# EAGLE design hedwig (EAGLE 9.6.2)

## Sheet 1 of 6
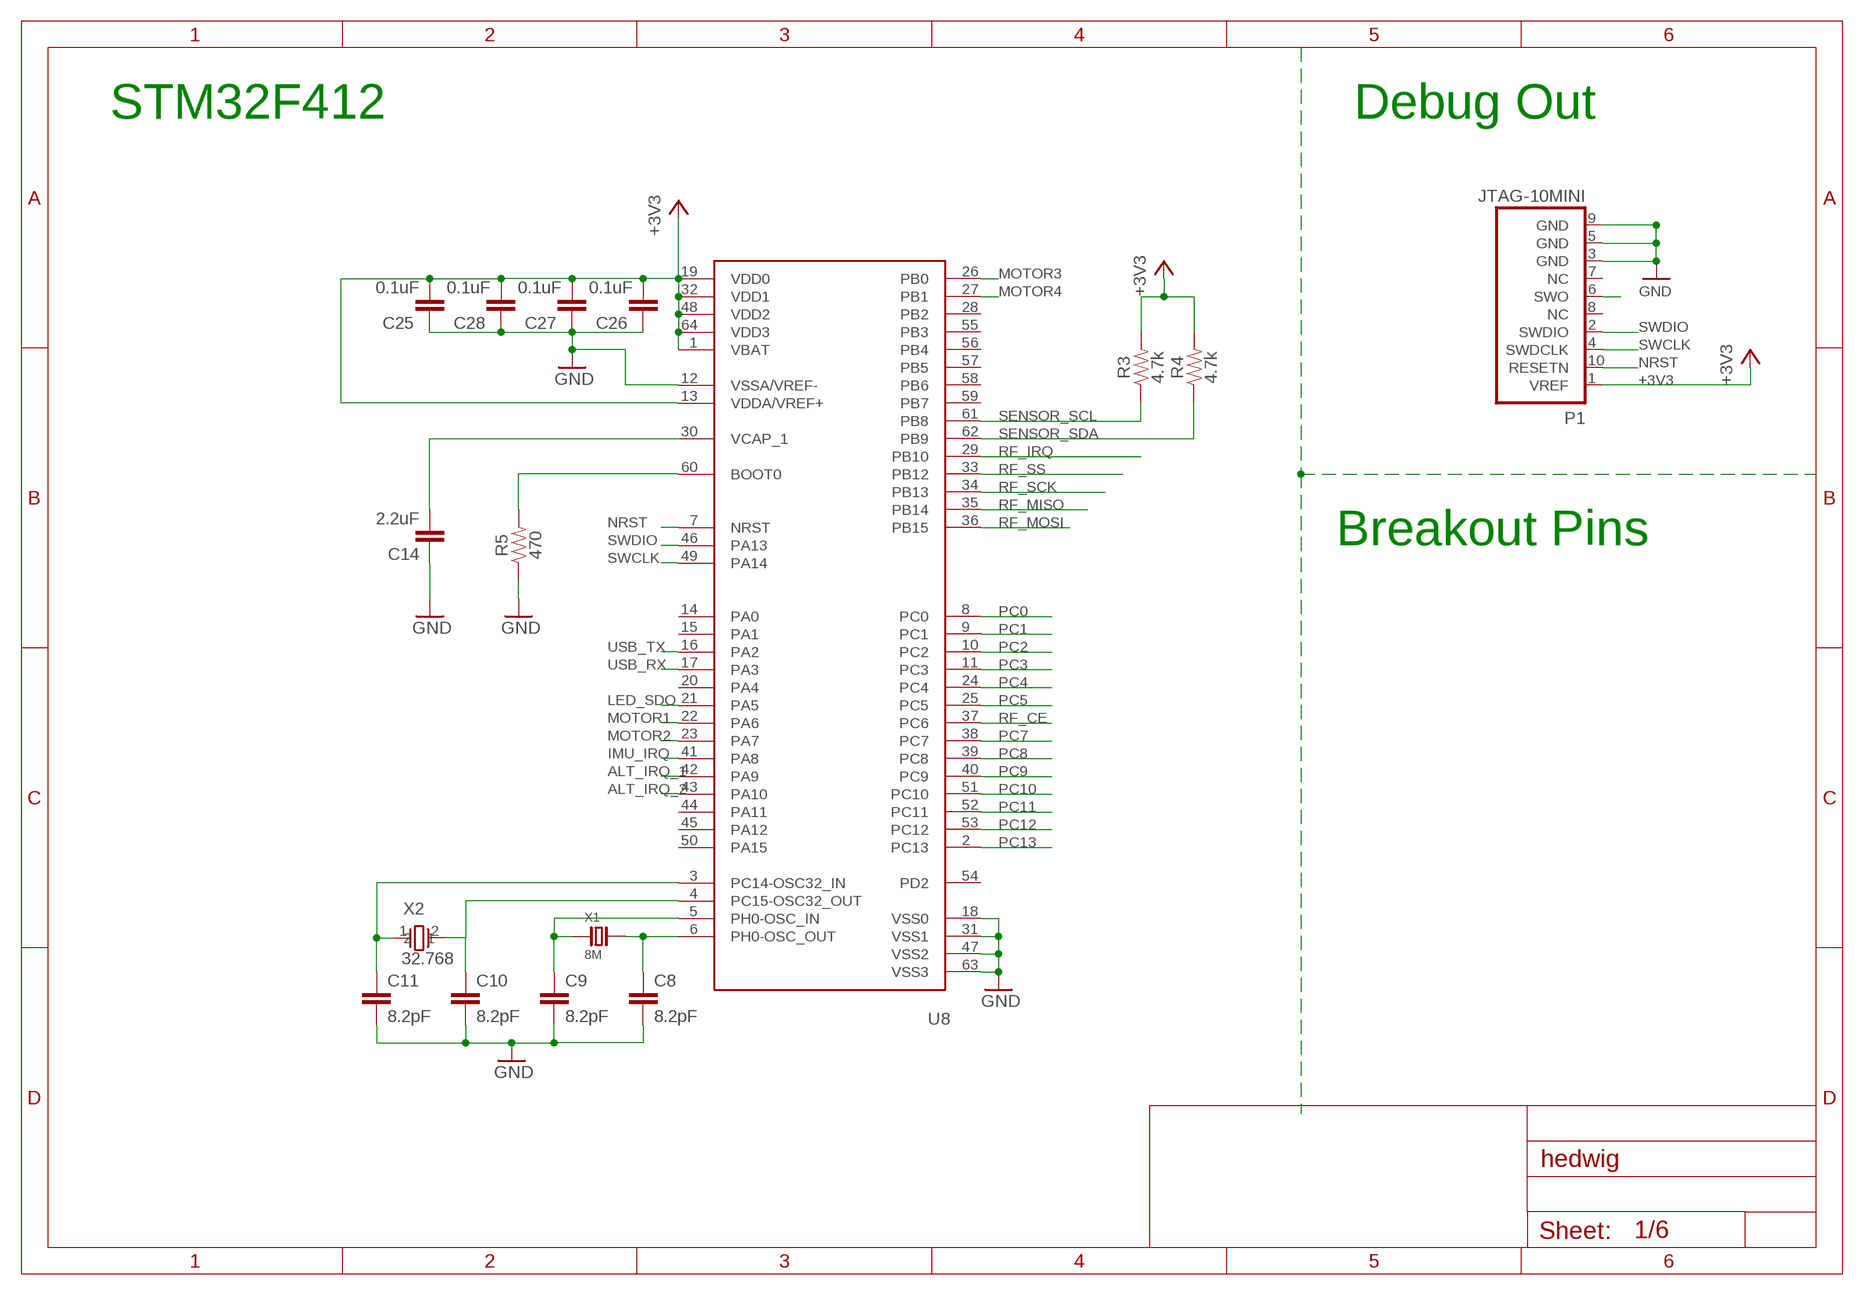
[diagram p0: schematic, sheet 1]

### Parts
C8  8.2pF  CAPACITOR_0603  [0603]
C9  8.2pF  CAPACITOR_0603  [0603]
C10  8.2pF  CAPACITOR_0603  [0603]
C11  8.2pF  CAPACITOR_0603  [0603]
C14  2.2uF  0.1UF-0603-25V-(+80/-20%)  [0603]
C25  0.1uF  0.1UF-0603-25V-(+80/-20%)  [0603]
C26  0.1uF  0.1UF-0603-25V-(+80/-20%)  [0603]
C27  0.1uF  0.1UF-0603-25V-(+80/-20%)  [0603]
C28  0.1uF  0.1UF-0603-25V-(+80/-20%)  [0603]
P1  JTAG-10MINI  [JTAG-10MINI]
R3  4.7k  1.5KOHM-0603-1/10W-1%  [0603]
R4  4.7k  1.5KOHM-0603-1/10W-1%  [0603]
R5  470  1.5KOHM-0603-1/10W-1%  [0603]
U8  STM32F412RE-S  [QFP50P1200X1200X160-64N]
X1  8M  CRYSTAL-NX3225GD  [NDK-NX3225GD]
X2  32.768  NX32  [NDK_NX3215SA-32.768K-STD-MUA-8_0]

### Nets
+3V3: C25.2 C26.2 C27.2 C28.2 P1.1(VREF) R3.2 R4.2 U8.1(VBAT) U8.13(VDDA/VREF+) U8.19(VDD0) U8.32(VDD1) U8.48(VDD2) U8.64(VDD3) ; also sheet 2,3,4,5,6
ALT_IRQ_1: U8.42(PA9) ; also sheet 3
ALT_IRQ_2: U8.43(PA10) ; also sheet 3
GND: C8.2 C9.2 C10.2 C11.2 C14.1 C25.1 C26.1 C27.1 C28.1 P1.3(GND) P1.5(GND) P1.9(GND) R5.1 U8.12(VSSA/VREF-) U8.18(VSS0) U8.31(VSS1) U8.47(VSS2) U8.63(VSS3) ; also sheet 2,3,4,5,6
IMU_IRQ: U8.41(PA8) ; also sheet 3
LED_SDO: U8.21(PA5) ; also sheet 5
MOTOR1: U8.22(PA6) ; also sheet 6
MOTOR2: U8.23(PA7) ; also sheet 6
MOTOR3: U8.26(PB0) ; also sheet 6
MOTOR4: U8.27(PB1) ; also sheet 6
N$8: C9.1 U8.5(PH0-OSC_IN) X1.1
N$10: C8.1 U8.6(PH0-OSC_OUT) X1.2
N$13: C11.1 U8.3(PC14-OSC32_IN) X2.1
N$14: C10.1 U8.4(PC15-OSC32_OUT) X2.2
N$16: R5.2 U8.60(BOOT0)
N$17: C14.2 U8.30(VCAP_1)
N$18: P1.6(SWO)
NRST: P1.10(RESETN) U8.7(NRST) ; also sheet 5
PC0: U8.8(PC0)
PC1: U8.9(PC1)
PC2: U8.10(PC2)
PC3: U8.11(PC3)
PC4: U8.24(PC4)
PC5: U8.25(PC5)
PC7: U8.38(PC7)
PC8: U8.39(PC8)
PC9: U8.40(PC9)
PC10: U8.51(PC10)
PC11: U8.52(PC11)
PC12: U8.53(PC12)
PC13: U8.2(PC13)
RF_CE: U8.37(PC6) ; also sheet 2
RF_IRQ: U8.29(PB10) ; also sheet 2
RF_MISO: U8.35(PB14) ; also sheet 2
RF_MOSI: U8.36(PB15) ; also sheet 2
RF_SCK: U8.34(PB13) ; also sheet 2
RF_SS: U8.33(PB12) ; also sheet 2
SENSOR_SCL: R3.1 U8.61(PB8) ; also sheet 3
SENSOR_SDA: R4.1 U8.62(PB9) ; also sheet 3
SWCLK: P1.4(SWDCLK) U8.49(PA14)
SWDIO: P1.2(SWDIO) U8.46(PA13)
USB_RX: U8.17(PA3) ; also sheet 4
USB_TX: U8.16(PA2) ; also sheet 4
Unconnected: P1.7(NC) P1.8(NC) U8.14(PA0) U8.15(PA1) U8.20(PA4) U8.28(PB2) U8.44(PA11) U8.45(PA12) U8.50(PA15) U8.54(PD2) U8.55(PB3) U8.56(PB4) U8.57(PB5) U8.58(PB6) U8.59(PB7)

### Notes on the sheet
- STM32F412 | Debug Out
- Breakout Pins

## Sheet 2 of 6
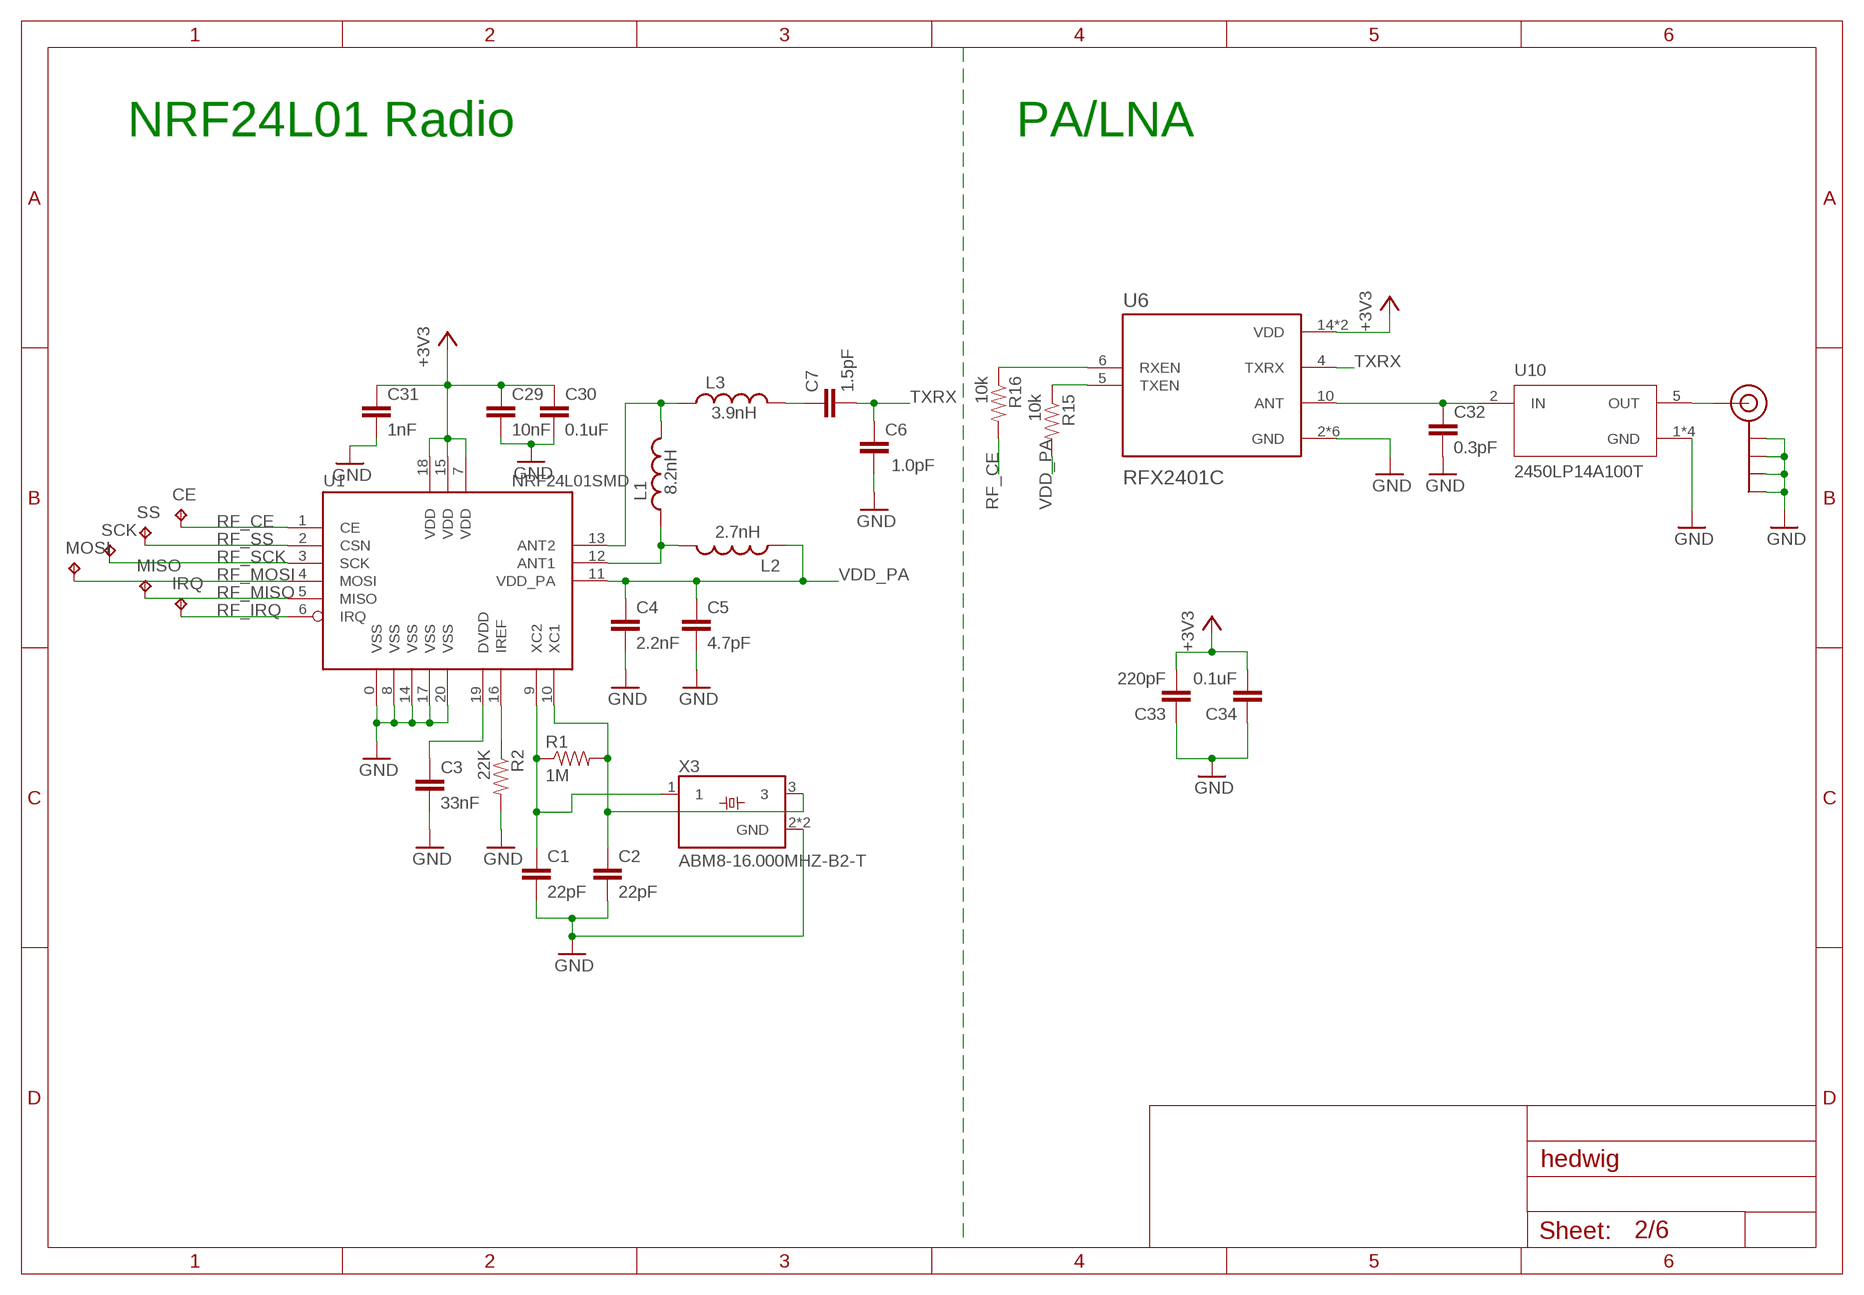
[diagram p1: schematic, sheet 2]

### Parts
C1  22pF  CAP0402  [C0402]
C2  22pF  CAP0402  [C0402]
C3  33nF  CAP0402  [C0402]
C4  2.2nF  CAP0402  [C0402]
C5  4.7pF  CAP0402  [C0402]
C6  1.0pF  CAP0402  [C0402]
C7  1.5pF  CAP0402  [C0402]
C29  10nF  CAP0402  [C0402]
C30  0.1uF  CAP0402  [C0402]
C31  1nF  CAP0402  [C0402]
C32  0.3pF  CAP0402  [C0402]
C33  220pF  CAP0402  [C0402]
C34  0.1uF  CAP0402  [C0402]
CE  TPB1,27  [B1,27]
IRQ  TPB1,27  [B1,27]
J3  SMA_EDGE  [SMA-EDGE]
L1  8.2nH  INDUCTOR0402  [C0402]
L2  2.7nH  INDUCTOR0402  [C0402]
L3  3.9nH  INDUCTOR0402  [C0402]
MISO  TPB1,27  [B1,27]
MOSI  TPB1,27  [B1,27]
R1  1M  RESISTOR0402  [C0402]
R2  22K  RESISTOR0402  [C0402]
R15  10k  RESISTOR0402  [C0402]
R16  10k  RESISTOR0402  [C0402]
SCK  TPB1,27  [B1,27]
SS  TPB1,27  [B1,27]
U1  NRF24L01SMD  [QFN20]
U6  RFX2401C  [QFN50P300X300X60-17N]
U10  2450LP14A100T  [ICCAF50P160X80X70-6N]
X3  ABM8-16.000MHZ-B2-T  [OSCSC320X250X100N]

### Nets
+3V3: C29.1 C30.1 C31.1 C33.2 C34.2 U1.7(VDD) U1.15(VDD) U1.18(VDD) U6.14(VDD) U6.16(VDD) ; also sheet 1,3,4,5,6
GND: C1.2 C2.2 C3.2 C4.2 C5.2 C6.1 C29.2 C30.2 C31.2 C32.2 C33.1 C34.1 J3.GND@0(GND) J3.GND@1(GND) J3.GND@2(GND) J3.GND@3(GND) R2.2 U1.0(VSS) U1.8(VSS) U1.14(VSS) U1.17(VSS) U1.20(VSS) U6.2(GND) U6.3(GND) U6.8(GND) U6.9(GND) U6.11(GND) U6.17(GND) U10.1(GND) U10.3(GND) U10.4(GND) U10.6(GND) X3.2(GND) X3.4(GND) ; also sheet 1,3,4,5,6
N$1: C1.1 R1.1 U1.9(XC2) X3.1
N$2: C2.1 R1.2 U1.10(XC1) X3.3
N$3: L1.1 L2.2 U1.12(ANT1)
N$4: R2.1 U1.16(IREF)
N$5: C3.1 U1.19(DVDD)
N$6: L1.2 L3.1 U1.13(ANT2)
N$9: C7.1 L3.2
N$37: C32.1 U6.10(ANT) U10.2(IN)
N$53: J3.SIG(SIGNAL) U10.5(OUT)
N$57: R16.1 U6.6(RXEN)
N$58: R15.1 U6.5(TXEN)
RF_CE: CE.TP R16.2 U1.1(CE) ; also sheet 1
RF_IRQ: IRQ.TP U1.6(IRQ) ; also sheet 1
RF_MISO: MISO.TP U1.5(MISO) ; also sheet 1
RF_MOSI: MOSI.TP U1.4(MOSI) ; also sheet 1
RF_SCK: SCK.TP U1.3(SCK) ; also sheet 1
RF_SS: SS.TP U1.2(CSN) ; also sheet 1
TXRX: C6.2 C7.2 U6.4(TXRX)
VDD_PA: C4.1 C5.1 L2.1 R15.2 U1.11(VDD_PA)

### Notes on the sheet
- NRF24L01 Radio | PA/LNA

## Sheet 3 of 6
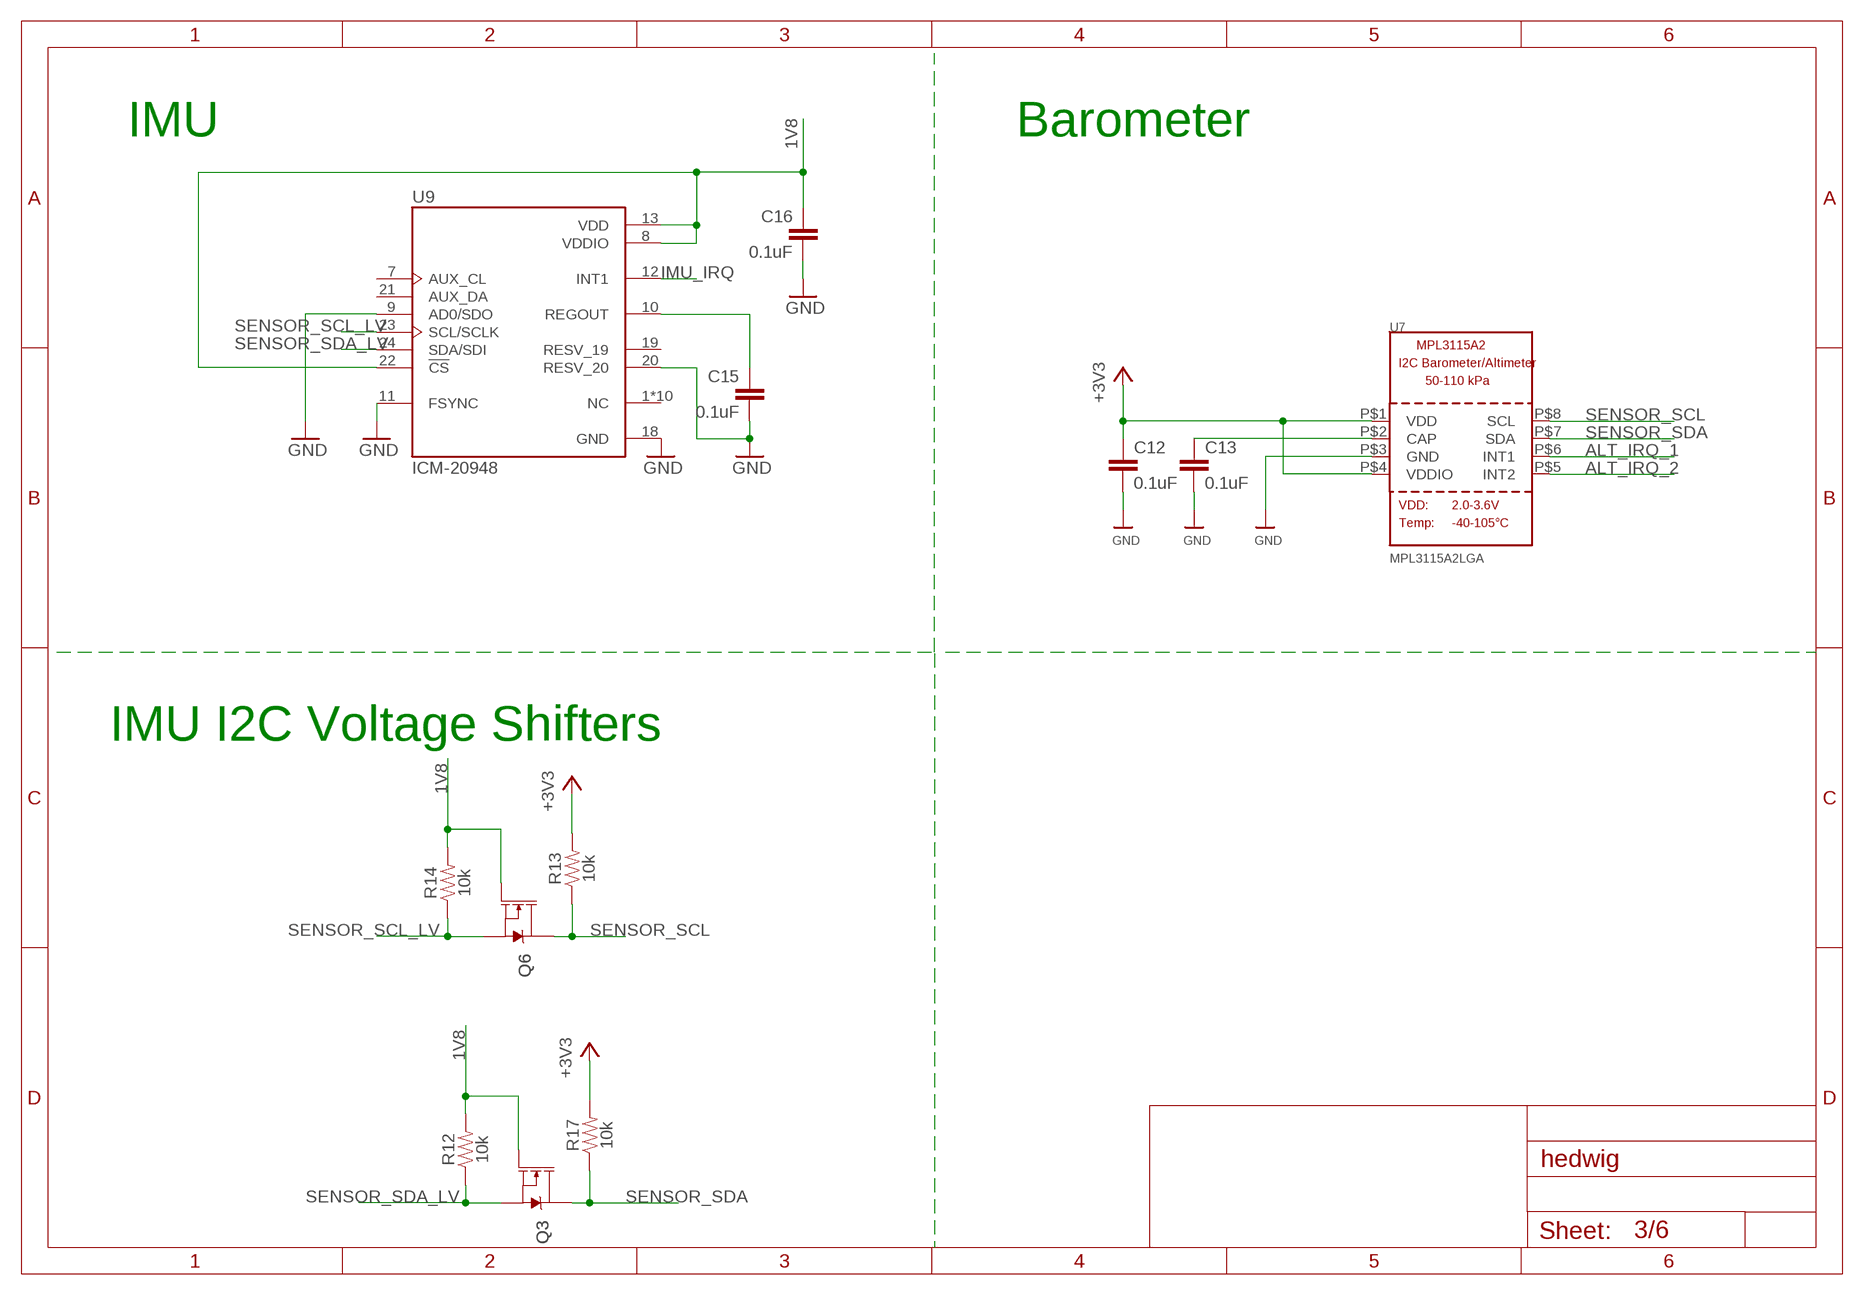
[diagram p2: schematic, sheet 3]

### Parts
C12  0.1uF  CAPACITOR_0603  [0603]
C13  0.1uF  CAPACITOR_0603  [0603]
C15  0.1uF  0.1UF-25V(+80/-20%)(0603)  [0603-CAP]
C16  0.1uF  0.1UF-25V(+80/-20%)(0603)  [0603-CAP]
Q3  20V/0.2A/8MHz/1.2Ω/1Vth  MOSFET-NCH-RE1C002UN  [SOT-416FL]
Q6  20V/0.2A/8MHz/1.2Ω/1Vth  MOSFET-NCH-RE1C002UN  [SOT-416FL]
R12  10k  2.49KOHM-0603-1/10W-1%  [0603]
R13  10k  2.49KOHM-0603-1/10W-1%  [0603]
R14  10k  2.49KOHM-0603-1/10W-1%  [0603]
R17  10k  2.49KOHM-0603-1/10W-1%  [0603]
U7  MPL3115A2LGA  [LGA8]
U9  ICM-20948  [QFN40P300X300X105-24N]

### Nets
1V8: C16.1 Q3.1(G) Q6.1(G) R12.2 R14.2 U9.8(VDDIO) U9.13(VDD) U9.22(!CS) ; also sheet 6
+3V3: C12.1 R13.2 R17.2 U7.P$1(VDD) U7.P$4(VDDIO) ; also sheet 1,2,4,5,6
ALT_IRQ_1: U7.P$6(INT1) ; also sheet 1
ALT_IRQ_2: U7.P$5(INT2) ; also sheet 1
CAP: C13.1 U7.P$2(CAP)
GND: C12.2 C13.2 C15.2 C16.2 U7.P$3(GND) U9.9(AD0/SDO) U9.11(FSYNC) U9.18(GND) U9.20(RESV_20) ; also sheet 1,2,4,5,6
IMU_IRQ: U9.12(INT1) ; also sheet 1
N$39: C15.1 U9.10(REGOUT)
SENSOR_SCL: Q6.3(D) R13.1 U7.P$8(SCL) ; also sheet 1
SENSOR_SCL_LV: Q6.2(S) R14.1 U9.23(SCL/SCLK)
SENSOR_SDA: Q3.3(D) R17.1 U7.P$7(SDA) ; also sheet 1
SENSOR_SDA_LV: Q3.2(S) R12.1 U9.24(SDA/SDI)
Unconnected: U9.1(NC) U9.2(NC) U9.3(NC) U9.4(NC) U9.5(NC) U9.6(NC) U9.7(AUX_CL) U9.14(NC) U9.15(NC) U9.16(NC) U9.17(NC) U9.19(RESV_19) U9.21(AUX_DA)

### Notes on the sheet
- IMU | Barometer
- IMU I2C Voltage Shifters

## Sheet 4 of 6
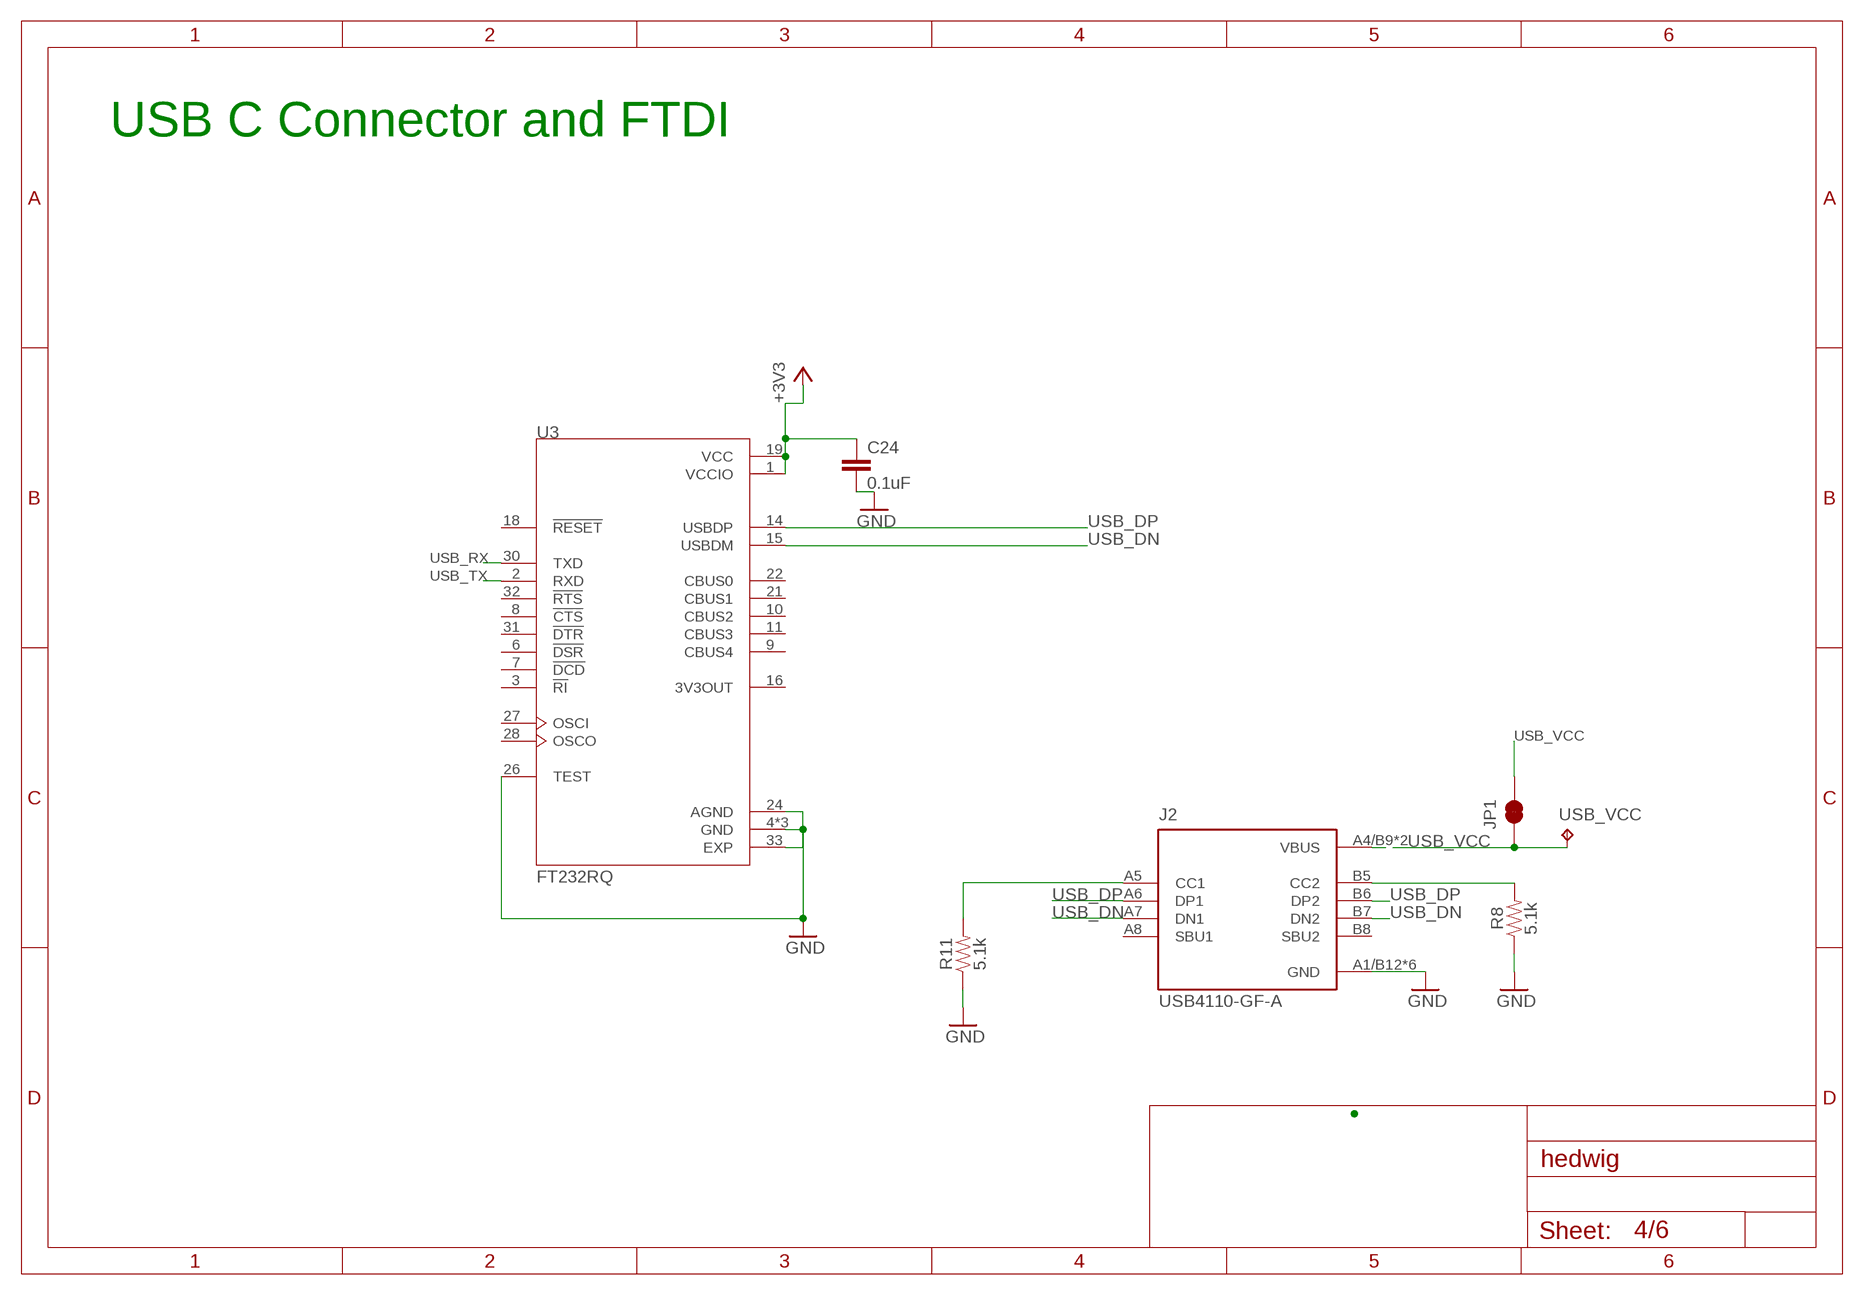
[diagram p3: schematic, sheet 4]

### Parts
C24  0.1uF  0.22UF-0603-25V-10%  [0603]
J2  USB4110-GF-A  [GCT_USB4110-GF-A]
JP1  JUMPER-SMT_2_NC_TRACE_SILK  [SMT-JUMPER_2_NC_TRACE_SILK]
R8  5.1k  5.1KOHM5.1KOHM-0603-1/10W-1%  [0603]
R11  5.1k  5.1KOHM5.1KOHM-0603-1/10W-1%  [0603]
U3  FT232RQ  [QFN50P500X500X90-33N]
USB_VCC  TPB2,54  [B2,54]

### Nets
+3V3: C24.1 U3.1(VCCIO) U3.19(VCC) ; also sheet 1,2,3,5,6
GND: C24.2 J2.A1/B12(GND) J2.B1/A12(GND) J2.S1(GND) J2.S2(GND) J2.S3(GND) J2.S4(GND) R8.1 R11.1 U3.4(GND) U3.17(GND) U3.20(GND) U3.24(AGND) U3.26(TEST) U3.33(EXP) ; also sheet 1,2,3,5,6
N$7: J2.B5(CC2) R8.2
N$26: J2.A5(CC1) R11.2
USB_DN: J2.A7(DN1) J2.B7(DN2) U3.15(USBDM)
USB_DP: J2.A6(DP1) J2.B6(DP2) U3.14(USBDP)
USB_RX: U3.30(TXD) ; also sheet 1
USB_TX: U3.2(RXD) ; also sheet 1
USB_VCC: J2.A4/B9(VBUS) J2.B4/A9(VBUS) JP1.1 JP1.2 USB_VCC.TP ; also sheet 5
Unconnected: J2.A8(SBU1) J2.B8(SBU2) U3.3(!RI) U3.6(!DSR) U3.7(!DCD) U3.8(!CTS) U3.9(CBUS4) U3.10(CBUS2) U3.11(CBUS3) U3.16(3V3OUT) U3.18(!RESET) U3.21(CBUS1) U3.22(CBUS0) U3.27(OSCI) U3.28(OSCO) U3.31(!DTR) U3.32(!RTS)

### Notes on the sheet
- USB C Connector and FTDI

## Sheet 5 of 6
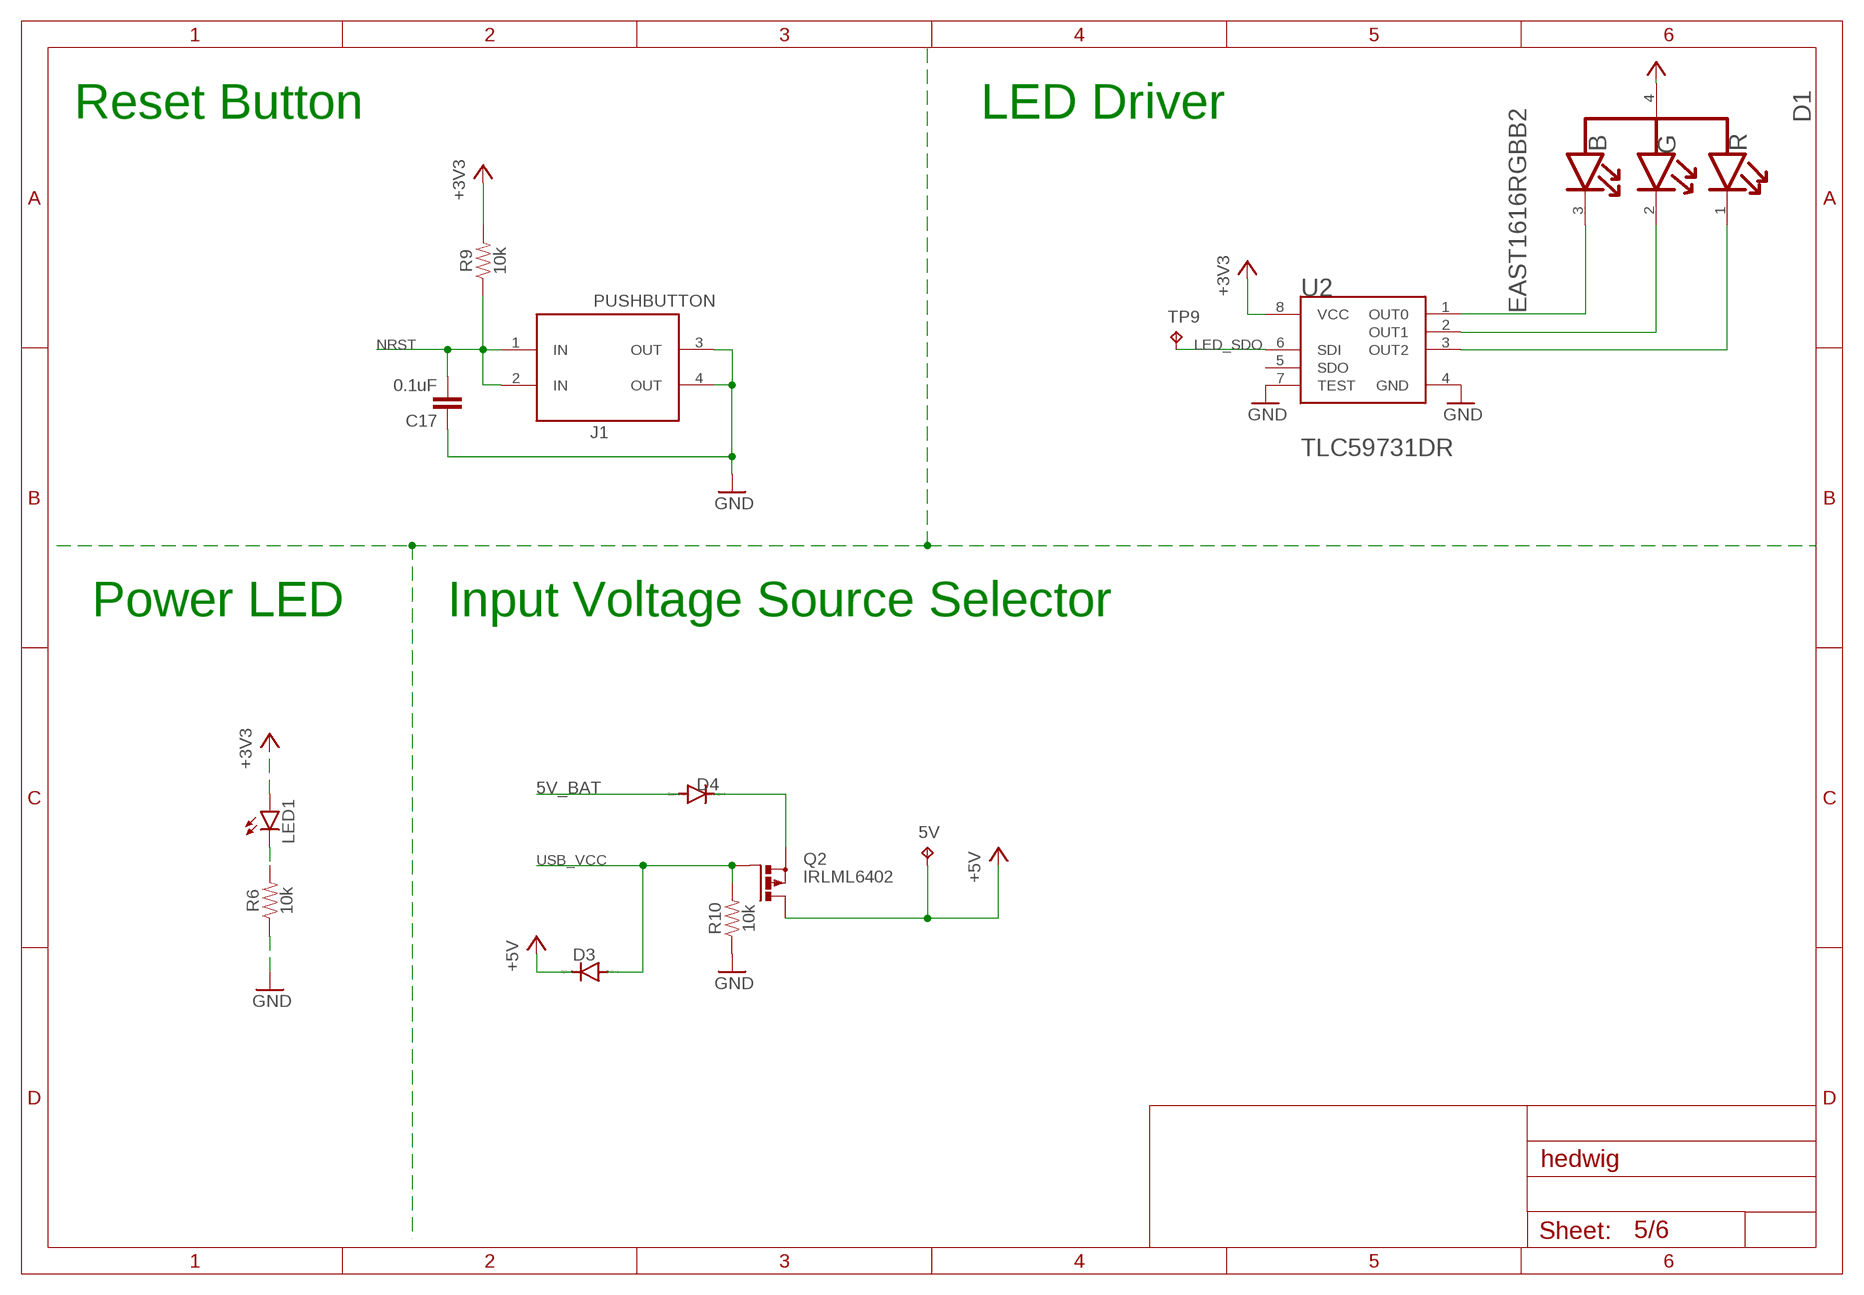
[diagram p4: schematic, sheet 5]

### Parts
5V  TPB2,54  [B2,54]
C17  0.1uF  0.1UF-0603-25V-(+80/-20%)  [0603]
D1  EVERLIGHT_EAST1616RGBB2EVERLIGHT_EAST1616RGBB2_0_0  [EVERLIGHT_EAST1616RGBB2_0]
D3  DIODE_0603  [DIODE_0603]
D4  DIODE_0603  [DIODE_0603]
J1  PUSHBUTTON  [PUSH_BUTTON]
LED1  LEDCHIPLED_1206  [CHIPLED_1206]
Q2  IRLML6402  [SOT-23]
R6  10k  10KOHM-0603-1/10W-1%  [0603]
R9  10k  1.5KOHM-0603-1/10W-1%  [0603]
R10  10k  2.49KOHM-0603-1/10W-1%  [0603]
TP9  TPB1,27  [B1,27]
U2  TEXAS_INSTRUMENTS_TLC59731DRTEXAS_INSTRUMENTS_TLC59731DR_0_0  [TEXAS_INSTRUMENTS_TLC59731DR_0]

### Nets
5V_BAT: D4.A ; also sheet 6
+3V3: D1.4(COMMON_ANODE) LED1.A R9.2 U2.8(VCC) ; also sheet 1,2,3,4,6
+5V: 5V.TP D3.C Q2.P3(D) ; also sheet 6
GND: C17.1 J1.3(OUT) J1.4(OUT) R6.1 R10.1 U2.4(GND) U2.7(TEST) ; also sheet 1,2,3,4,6
LED_SDO: TP9.TP U2.6(SDI) ; also sheet 1
N$11: D1.1(RED_CATHODE) U2.3(OUT2)
N$12: D1.3(BLUE_CATHODE) U2.1(OUT0)
N$25: LED1.C R6.2
N$27: D1.2(GREEN_CATHODE) U2.2(OUT1)
N$34: D4.C Q2.P2(S)
NRST: C17.2 J1.1(IN) J1.2(IN) R9.1 ; also sheet 1
USB_VCC: D3.A Q2.P1(G) R10.2 ; also sheet 4
Unconnected: U2.5(SDO)

### Notes on the sheet
- Reset Button | LED Driver
- Power LED | Input Voltage Source Selector

## Sheet 6 of 6
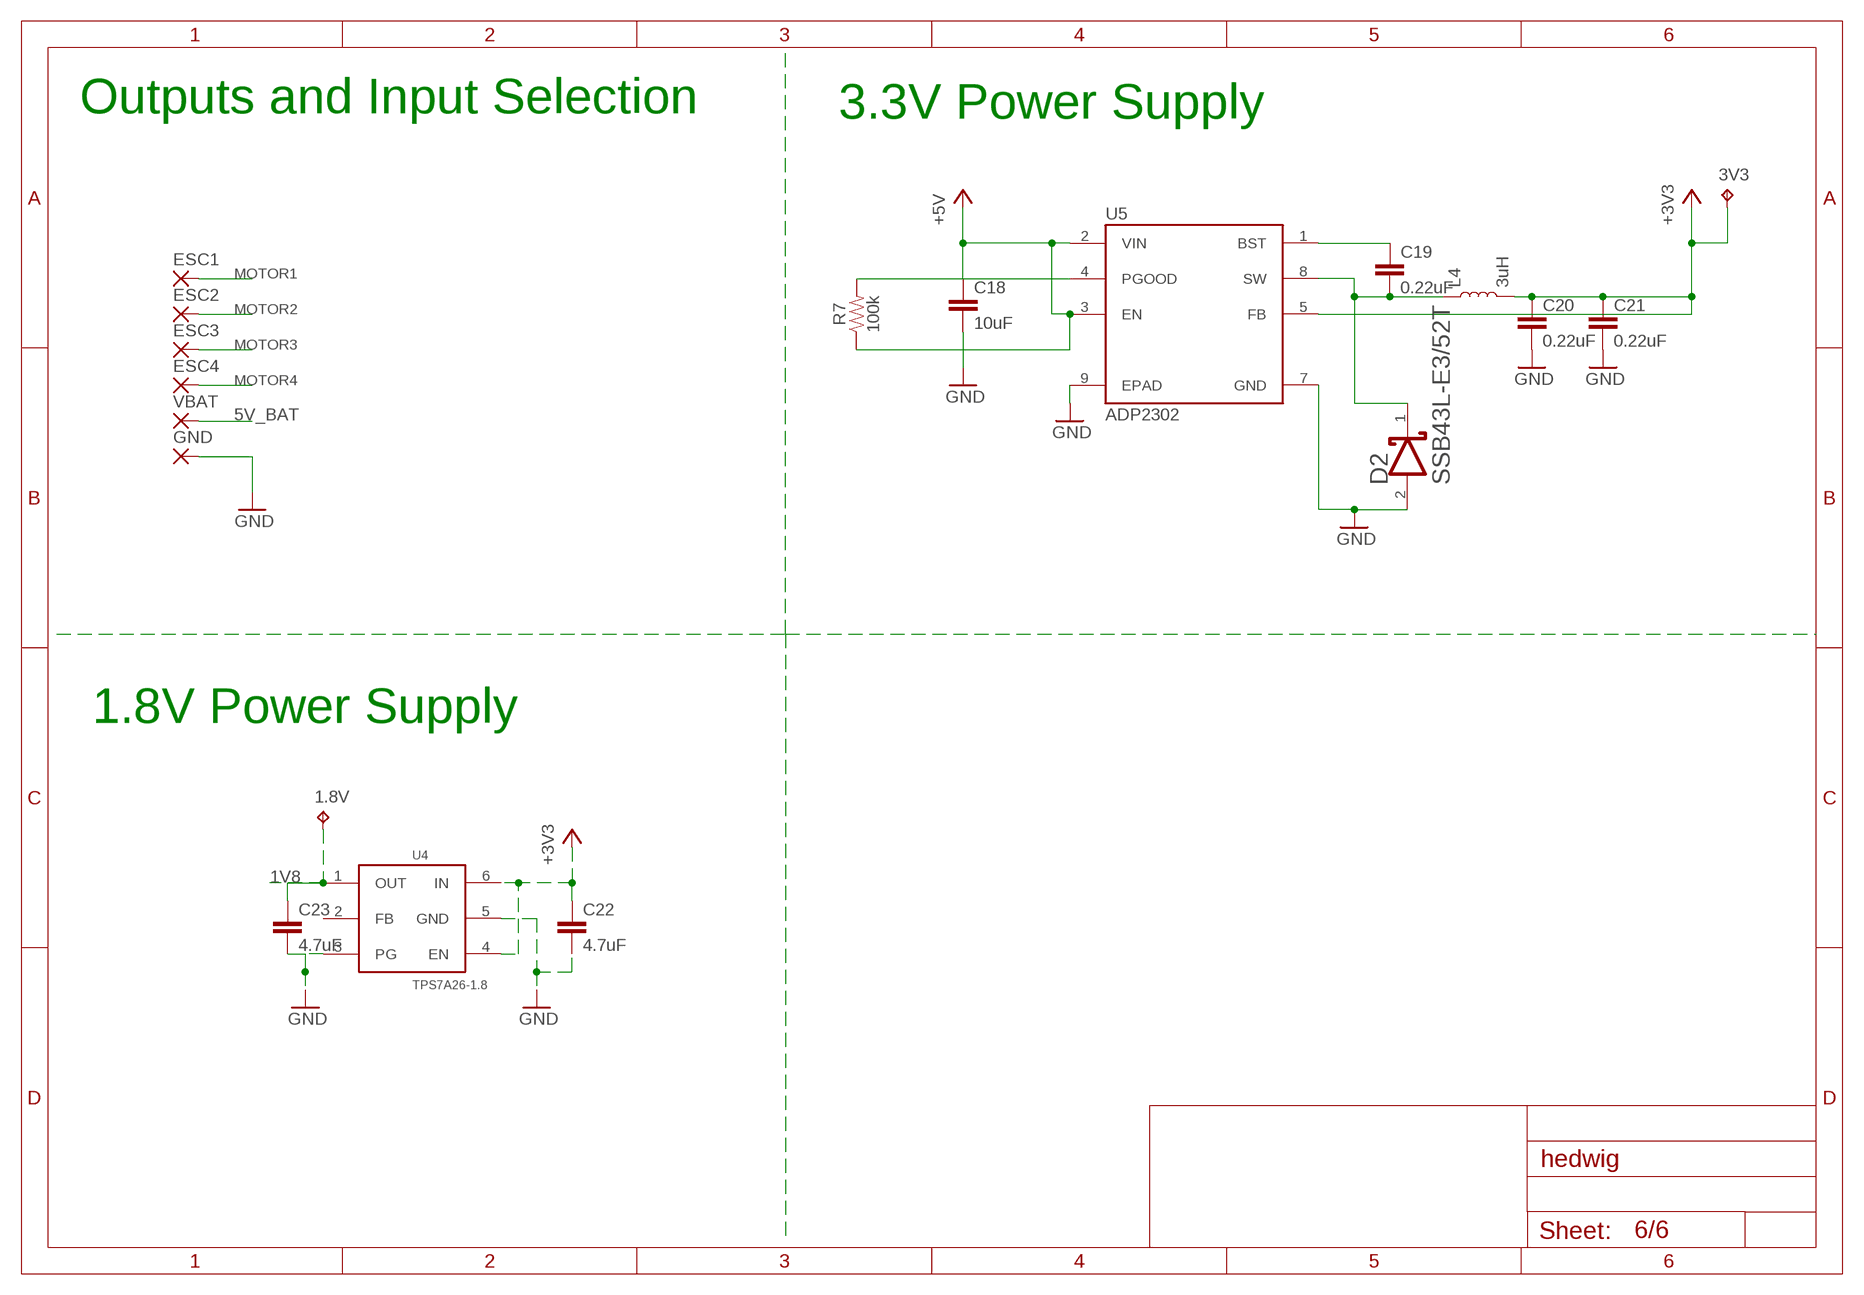
[diagram p5: schematic, sheet 6]

### Parts
1.8V  TPB2,54  [B2,54]
3V3  TPB2,54  [B2,54]
C18  10uF  10UF-0603-6.3V-20%  [0603]
C19  0.22uF  0.22UF-0603-25V-10%  [0603]
C20  0.22uF  0.22UF-0603-25V-10%  [0603]
C21  0.22uF  0.22UF-0603-25V-10%  [0603]
C22  4.7uF  4.7UF-0603-35V-(20%)  [0603]
C23  4.7uF  4.7UF-0603-35V-(20%)  [0603]
D2  SSB43L  VISHAY_SSB43L-E3-52TVISHAY_SSB43L-E3-52T_0_0  [VISHAY_SSB43L-E3-52T_0]
ESC1  SMD2  [SMD1,27-2,54]
ESC2  SMD2  [SMD1,27-2,54]
ESC3  SMD2  [SMD1,27-2,54]
ESC4  SMD2  [SMD1,27-2,54]
GND  2,54/1,0  [2,54/1,0]
L4  3uH  REG_INDUCTOR  [REG_INDUCTOR]
R7  100k  100KOHM-0603-1/10W-1%  [0603]
U4  TPS7A26-1.8  [WSON]
U5  ADP2302  [SOIC127P600X175-9N]
VBAT  2,54/1,0  [2,54/1,0]

### Nets
1V8: 1.8V.TP C23.1 U4.1(OUT) ; also sheet 3
5V_BAT: VBAT.1(P) ; also sheet 5
+3V3: 3V3.TP C20.1 C21.1 C22.1 L4.@2 U4.4(EN) U4.6(IN) U5.5(FB) ; also sheet 1,2,3,4,5
+5V: C18.1 R7.1 U5.2(VIN) U5.3(EN) ; also sheet 5
GND: C18.2 C20.2 C21.2 C22.2 C23.2 D2.2(ANODE) GND.1(P) U4.3(PG) U4.5(GND) U5.7(GND) U5.9(EPAD) ; also sheet 1,2,3,4,5
MOTOR1: ESC1.1(P) ; also sheet 1
MOTOR2: ESC2.1(P) ; also sheet 1
MOTOR3: ESC3.1(P) ; also sheet 1
MOTOR4: ESC4.1(P) ; also sheet 1
N$20: C19.1 U5.1(BST)
N$23: R7.2 U5.4(PGOOD)
N$24: C19.2 D2.1(CATHODE) L4.@1 U5.8(SW)
Unconnected: U4.2(FB)

### Notes on the sheet
- Outputs and Input Selection | 3.3V Power Supply
- 1.8V Power Supply

## Library data of the parts
1.8V 3V3 5V CE IRQ MISO MOSI SCK SS TP9 USB_VCC = testpad:TP: Test pad
C1-C7 C29-C34 = SparkFun:CAP: Capacitor Standard 0603 ceramic capacitor, and 0.1" leaded capacitor.
C8-C13 = falcon:CAPACITOR_0603
C14 = SparkFun-Capacitors:0.1UF: 0.1µF ceramic capacitors A capacitor is a passive two-terminal electrical component used to store electrical energy temporarily in an electric field.; PROD_ID: CAP-00810; VALUE: 0.1uF
C15 C16 = SparkFun-Capacitors:0.1UF-25V(+80/-20%)(0603): CAP-00810 Ceramic Standard decoupling cap; PROD_ID: CAP-00810
C17 C25-C28 = SparkFun-Capacitors:0.1UF: 0.1µF ceramic capacitors A capacitor is a passive two-terminal electrical component used to store electrical energy temporarily in an electric field.; PROD_ID: CAP-00810
C18 = SparkFun-Capacitors:10UF: 10.0µF ceramic capacitors A capacitor is a passive two-terminal electrical component used to store electrical energy temporarily in an electric field.; PROD_ID: CAP-11015
C19-C21 = SparkFun-Capacitors:0.22UF: 0.22µF ceramic capacitors A capacitor is a passive two-terminal electrical component used to store electrical energy temporarily in an electric field.; PROD_ID: CAP-07822
C22 C23 = SparkFun-Capacitors:4.7UF: 4.7µF ceramic capacitors A capacitor is a passive two-terminal electrical component used to store electrical energy temporarily in an electric field.; PROD_ID: CAP-14106
C24 = SparkFun-Capacitors:0.22UF: 0.22µF ceramic capacitors A capacitor is a passive two-terminal electrical component used to store electrical energy temporarily in an electric field.; PROD_ID: CAP-07822; VALUE: 0.22uF
D1 = Everlight - EAST1616RGBB2:EVERLIGHT_EAST1616RGBB2: Red, Green, Blue (RGB) LED Indication - Discrete 1.9V Red, 2.8V Green, 2.8V Blue 0606 (1616 Metric); AUTOMOTIVE: No; CENTROID_NOT_SPECIFIED: No; COLOUR: Blue, Green, Red; DATASHEET: https://everlightamericas.com/index.php?controller=attachment&id_attachment=2426; DEVICE_CLASS_L1: Optoelectronics; DEVICE_CLASS_L2: LEDs; DEVICE_CLASS_L3: unset; DIGIKEY_DESCRIPTION: DIODE LED RGB DIFFUSED 4SMD; DIGIKEY_PART_NUMBER: 1080-1551-1-ND; FOOTPRINT_VARIANT_NAME_0: Recommended_Land_Pattern; FORWARD_CURRENT: 5mA; FORWARD_VOLTAGE: 3/3/2.1V; HEIGHT: 0.45mm; LEAD_FREE: Yes; LED_ORIENTATION: Top View; LUMINOUS_INTENSITY: 36/140/45mcd; MF: Everlight; MFG_PACKAGE_IDENT: 0; MFG_PACKAGE_IDENT_DATE: 0; MFG_PACKAGE_IDENT_REV: 0; MOUSER_PART_NUMBER: 638-EAST1616RGBB2; MPN: EAST1616RGBB2; PACKAGE: 0606; PEAK_EMMISION_WAVELENGTH: 468/518/632nm; POWER_DISSIPATION: 95/95/60mW; PREFIX: D; REVERSE_VOLTAGE: 5V; ROHS: Yes; TEMPERATURE_RANGE_HIGH: +85°C; TEMPERATURE_RANGE_LOW: -40°C; VERIFICATION_VERSION: 0.0.0.3; VIEWING_ANGLE: 120°; WAVELENGTH: 475/535/628nm
D2 = 52T:VISHAY_SSB43L-E3-52T: Diode Schottky 30V 4A 2-Pin SMB T/R; CENTROID_NOT_SPECIFIED: No; DATASHEET: http://www.vishay.com/docs/88884/ssb43l.pdf; DC_BLOCKING_VOLTAGE: 30V; DEVICE_CLASS_L1: Discrete Semiconductors; DEVICE_CLASS_L2: Diodes; DEVICE_CLASS_L3: Schottky Diodes; DIGIKEY_DESCRIPTION: DIODE SCHOTTKY 30V 4A DO214AA; DIGIKEY_PART_NUMBER: SSB43L-E3/52TGICT-ND; FORWARD_CURRENT: 4A; HEIGHT: 2.44mm; LEAD_FREE: yes; MAX_JUNCTION_TEMP: +150°C; MAX_REPETITIVE_REVERSE_VOLTAGE: 30V; MAX_SURGE_FORWARD_CURRENT: 100A; MF: Vishay; MFG_PACKAGE_IDENT: SSB43L-E3/52T; MFG_PACKAGE_IDENT_DATE: 0; MFG_PACKAGE_IDENT_REV: 0; MOUSER_DESCRIPTION: Schottky Diodes & Rectifiers 4.0 Amp 30 Volt; MOUSER_PART_NUMBER: 625-SSB43L-E3; MPN: SSB43L-E3/52T; PACKAGE: SMB; PEAK_REVERSE_CURRENT: 0.6mA; PREFIX: D; REVERSE_VOLTAGE: 21V; ROHS: yes; STANDOFF_HEIGHT: 0mm; TEMPERATURE_RANGE_HIGH: +150°C; TEMPERATURE_RANGE_LOW: -65°C; VERIFICATION_VERSION: 0.0.0.1
D3 D4 = falcon:DIODE_0603
ESC1-ESC4 = wirepad:SMD2: SMD PAD
GND VBAT = wirepad:2,54/1,0: THROUGH-HOLE PAD
J1 = falcon:PUSHBUTTON
J2 = USB4110-GF-A:USB4110-GF-A: CONN USB 2.0 TYPE-C R/A SMT Check prices <https://pricing.snapeda.com/parts/USB4110-GF-A/GCT/view-part?ref=eda>; AVAILABILITY: Warning; DESCRIPTION: USB-C (USB TYPE-C) USB 2.0 Receptacle Connector 24 (16+8 Dummy) Position Surface Mount, Right Angle; Through Hole; MF: GCT; MP: USB4110-GF-A; PACKAGE: None; PRICE: None; PURCHASE-URL: https://pricing.snapeda.com/search/part/USB4110-GF-A/?ref=eda
J3 = SparkFun:SMA_EDGE: SMA Antenna Connector End launch SMA connector. The paste layer has been removed so that the connector can be hand soldered onto the board after reflow.
JP1 = SparkFun-Jumpers:JUMPER-SMT_2_NC_TRACE: Normally closed trace jumper This jumper has a trace between two pads so it's normally closed (NC). Use a razor knife to open the connection. For best results follow the IPC guidelines for cutting traces: Cutout at least 0.063 mm (0.005 in). Remove all loose material to clean up the cut area. Seal the cut with an approved epoxy. Reapply solder to reclose the connection.
L1-L3 = SparkFun:INDUCTOR: Inductors Basic Inductor/Choke - 0603 and 1206. Footprints are not proven and vary greatly between part numbers.
L4 = falcon:REG_INDUCTOR
LED1 = led:LED: LED OSRAM: - CHIPLED LG R971, LG N971, LY N971, LG Q971, LY Q971, LO R971, LY R971 LH N974, LH R974 LS Q976, LO Q976, LY Q976 LO Q996 - Hyper CHIPLED LW Q18S LB Q993, LB Q99A, LB R99A - SideLED LS A670, LO A670, LY A670, LG A670, LP A670 LB A673, LV A673, LT A673, LW A673 LH A674 LY A675 LS A676, LA A676, LO A676, LY A676, LW A676 LS A679, LY A679, LG A679 - Hyper Micro SIDELED® LS Y876, LA Y876, LO Y876, LY Y876 LT Y87S - SmartLED LW L88C, LW L88S LB L89C, LB L89S, LG L890 LS L89K, LO L89K, LY L89K LS L896, LA L896, LO L896, LY L896 - TOPLED LS T670, LO T670, LY T670, LG T670, LP T670 LSG T670, LSP T670, LSY T670, LOP T670, LYG T670 LG T671, LOG T671, LSG T671 LB T673, LV T673, LT T673, LW T673 LH T674 LS T676, LA T676, LO T676, LY T676, LB T676, LH T676, LSB T676, LW T676 LB T67C, LV T67C, LT T67C, LS T67K, LO T67K, LY T67K, LW E67C LS E67B, LA E67B, LO E67B, LY E67B, LB E67C, LV E67C, LT E67C LW T67C LS T679, LY T679, LG T679 LS T770, LO T770, LY T770, LG T770, LP T770 LB T773, LV T773, LT T773, LW T773 LH T774 LS E675, LA E675, LY E675, LS T675 LS T776, LA T776, LO T776, LY T776, LB T776 LHGB T686 LT T68C, LB T68C - Hyper Mini TOPLED® LB M676 - Mini TOPLED Santana® LG M470 LS M47K, LO M47K, LY M47K Source: http://www.osram.convergy.de LUXEON: - LUMILED® LXK2-PW12-R00, LXK2-PW12-S00, LXK2-PW14-U00, LXK2-PW14-V00 LXK2-PM12-R00, LXK2-PM12-S00, LXK2-PM14-U00 LXK2-PE12-Q00, LXK2-PE12-R00, LXK2-PE12-S00, LXK2-PE14-T00, LXK2-PE14-U00 LXK2-PB12-K00, LXK2-PB12-L00, LXK2-PB12-M00, LXK2-PB14-N00, LXK2-PB14-P00, LXK2-PB14-Q00 LXK2-PR12-L00, LXK2-PR12-M00, LXK2-PR14-Q00, LXK2-PR14-R00 LXK2-PD12-Q00, LXK2-PD12-R00, LXK2-PD12-S00 LXK2-PH12-R00, LXK2-PH12-S00 LXK2-PL12-P00, LXK2-PL12-Q00, LXK2-PL12-R00 Source: www.luxeon.com KINGBRIGHT: KA-3528ASYC Source: www.kingbright.com
P1 = falcon:JTAG-10MINI
Q2 = mosfet:IRLML6402: Pch MOSFET IRLML6402 20V 3.7A http://akizukidenshi.com/catalog/g/gI-02553/ I-02553
Q3 Q6 = SparkFun-DiscreteSemi:MOSFET-NCH: N-channel MOSFETs Voltage controlled devices that allow control of high current outputs. SparkFun Products: SparkFun OpenScale <https://www.sparkfun.com/products/13261> SparkFun Digital Sandbox <https://www.sparkfun.com/products/12651> SparkFun Monster Moto Shield <https://www.sparkfun.com/products/10182> SparkFun MOSFET Power Controller <https://www.sparkfun.com/products/11214>; PROD_ID: TRANS_14399
R1 R2 R15 R16 = SparkFun:RESISTOR: Resistor Basic schematic elements and footprints for 0603, 1206, and PTH 1/10th watt (small) resistors.
R3-R5 R9 = SparkFun-Resistors:1.5KOHM: 1.5kΩ resistor A resistor is a passive two-terminal electrical component that implements electrical resistance as a circuit element. Resistors act to reduce current flow, and, at the same time, act to lower voltage levels within circuits. - Wikipedia; PROD_ID: RES-08306; VALUE: 1.5k
R6 = SparkFun-Resistors:10KOHM: 10kΩ resistor A resistor is a passive two-terminal electrical component that implements electrical resistance as a circuit element. Resistors act to reduce current flow, and, at the same time, act to lower voltage levels within circuits. - Wikipedia; PROD_ID: RES-00824
R7 = SparkFun-Resistors:100KOHM: 100kΩ resistor A resistor is a passive two-terminal electrical component that implements electrical resistance as a circuit element. Resistors act to reduce current flow, and, at the same time, act to lower voltage levels within circuits. - Wikipedia; PROD_ID: RES-07828
R8 R11 = SparkFun-Resistors:5.1KOHM; PROD_ID: RES-12083
R10 R12-R14 R17 = SparkFun-Resistors:2.49KOHM: 2.49kΩ resistor A resistor is a passive two-terminal electrical component that implements electrical resistance as a circuit element. Resistors act to reduce current flow, and, at the same time, act to lower voltage levels within circuits. - Wikipedia; PROD_ID: RES-09568; VALUE: 2.49k
U1 = SparkFun:NRF24L01: 2.4GHz Low Power Transceiver This is the very popular, low cost, very low power RF transceiver from Nordic Semiconductor. Simple SPI interface. SKU: COM-00690
U2 = Texas Instruments - TLC59731DR:TEXAS_INSTRUMENTS_TLC59731DR: 3-Channel, 8-Bit, PWM LED Driver With Single-Wire Interface; CENTROID_NOT_SPECIFIED: No; CURRENT_-_OUTPUT_/_CHANNEL: 50mA; DATASHEET: http://www.ti.com/lit/ds/symlink/tlc59731.pdf; DIGIKEY_DESCRIPTION: IC LED DRVR PWM 8B 3CH 8SOIC; DIGIKEY_PART_NUMBER: 296-40590-1-ND; FREQUENCY: 6MHz; LEAD_FREE: yes; MF: Texas Instruments; MFG_PACKAGE_IDENT: D (R-PDSO-G8); MOUSER_PART_NUMBER: 595-TLC59731DR; MPN: TLC59731DR; PACKAGE: SOIC8; PREFIX: U; ROHS: yes; TEMPERATURE_RANGE_HIGH: +125°C; TEMPERATURE_RANGE_LOW: -40°C
U3 = FT232RQ:FT232RQ: USB-to-UART 1-CH 256Byte FIFO 5V 32-Pin QFN EP; AVAILABILITY: Unavailable; DESCRIPTION: USB Bridge, USB to UART USB 2.0 UART Interface 32-QFN (5x5); MF: FTDI, Future; MP: FT232RQ; PACKAGE: VFQFN-32 FTDI, Future; PRICE: None
U4 = falcon:TPS7A26-1.8
U5 = falcon:ADP2302
U6 = RFX2401C:RFX2401C: None Check prices <https://pricing.snapeda.com/parts/RFX2401C/Skyworks%20Solutions/view-part?ref=eda>; AVAILABILITY: Warning; DESCRIPTION: RF Front End 2.4GHz ~ 2.5GHz 802.15.4, Zigbee® 16-QFN (3x3); MF: Skyworks Solutions; MP: RFX2401C; PACKAGE: UFQFN-16 Skyworks Solutions; PRICE: None; PURCHASE-URL: https://pricing.snapeda.com/search/part/RFX2401C/?ref=eda
U7 = microbuilder:MPL3115A2
U8 = mystm2:STM32F412RE-S
U9 = ICM-20948:ICM-20948: Accelerometer, Gyroscope, Magnetometer, 9 Axis Sensor I²C, SPI Output; DESCRIPTION: Accelerometer, Gyroscope, Magnetometer, 9 Axis Sensor I²C, SPI Output; DIGI-KEY_PART_NUMBER: 1428-1123-1-ND; MF: TDK InvenSense; MP: ICM-20948; PACKAGE: None; PURCHASE-URL: https://pricing.snapeda.com/search/part/ICM-20948/?ref=eda
U10 = 2450LP14A100T:2450LP14A100T: Ceramic Filters Low Pass 0.5dB 50Ohm SMD 6Pin Check prices <https://pricing.snapeda.com/parts/2450LP14A100T/Johanson%20Technology/view-part?ref=eda>; AVAILABILITY: Good; DESCRIPTION: 2.45GHz Center Frequency Low Pass RF Filter (Radio Frequency) 100MHz Bandwidth 0.5dB 0603 (1608 Metric), 6 PC Pad; MF: Johanson Technology; MP: 2450LP14A100T; PACKAGE: 0603 Johanson Technology; PRICE: None; PURCHASE-URL: https://pricing.snapeda.com/search/part/2450LP14A100T/?ref=eda
X1 = FaBo-Crystal:CRYSTAL
X2 = NDK - NX3215SA-32.768K-STD-MUA-8:NX32
X3 = ABM8-16.000MHZ-B2-T:ABM8-16.000MHZ-B2-T: Crystal 20MHz Â±20ppm (Tol) Â±30ppm (Stability) 18pF FUND 80Ohm 4-Pin Mini-CSMD T/R Check prices <https://pricing.snapeda.com/parts/ABM8-16.000MHZ-B2-T/Abracon/view-part?ref=eda>; AVAILABILITY: Good; DESCRIPTION: 16MHz ±20ppm Crystal 18pF 70 Ohms 4-SMD, No Lead; MF: Abracon; MP: ABM8-16.000MHZ-B2-T; PACKAGE: SMD-4 Abracon; PRICE: None; PURCHASE-URL: https://pricing.snapeda.com/search/part/ABM8-16.000MHZ-B2-T/?ref=eda

## Board
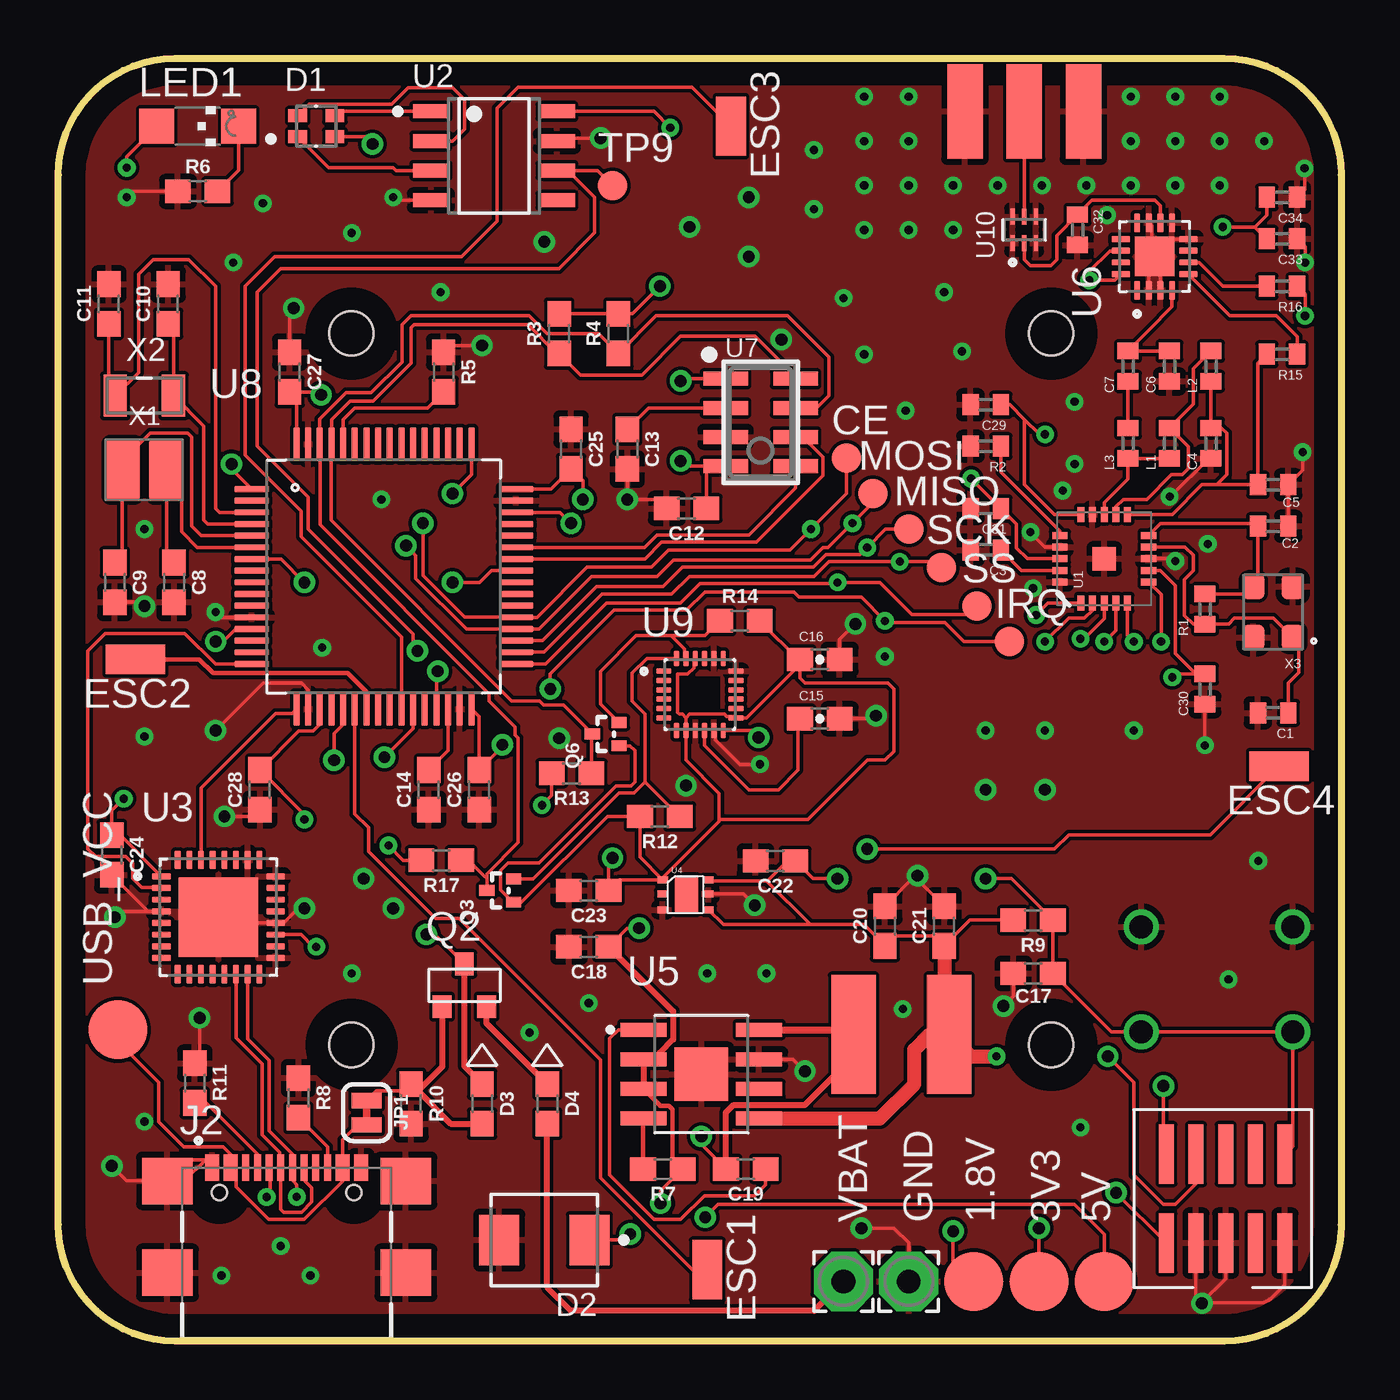
[diagram p6: board, top side]
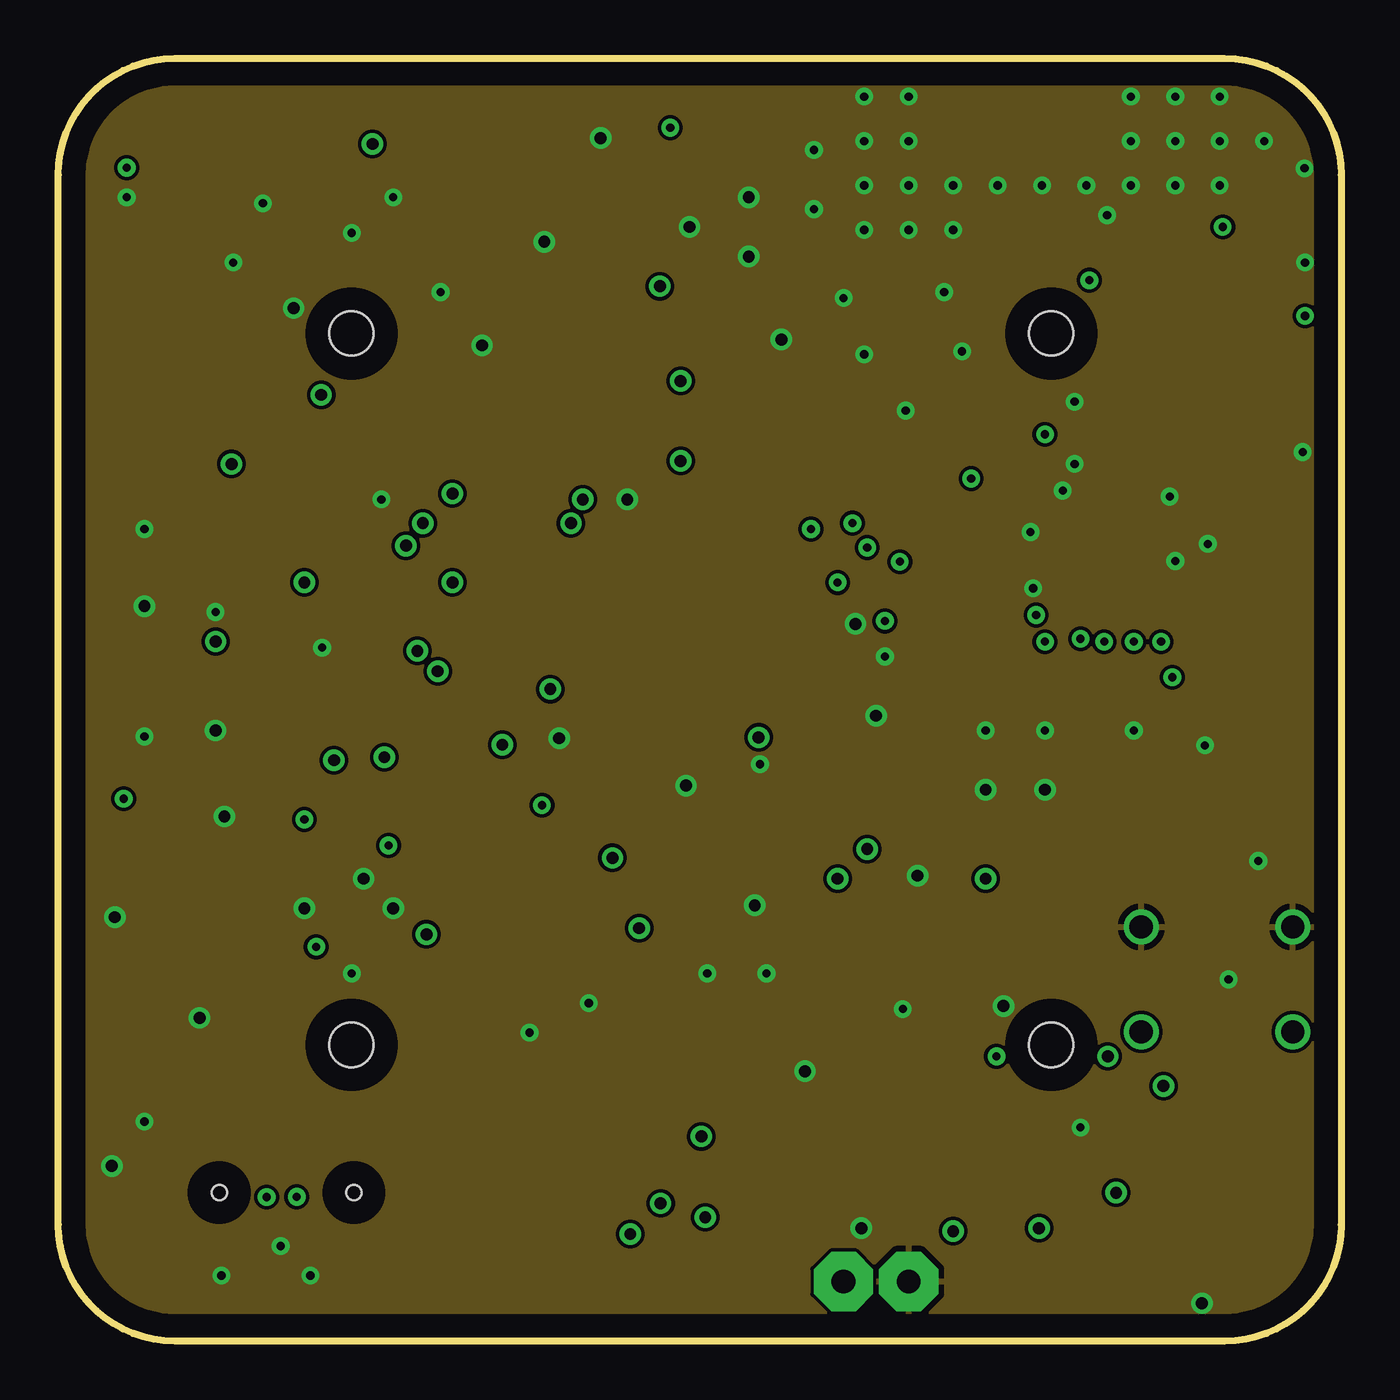
[diagram p7: board, inner layer Route2]
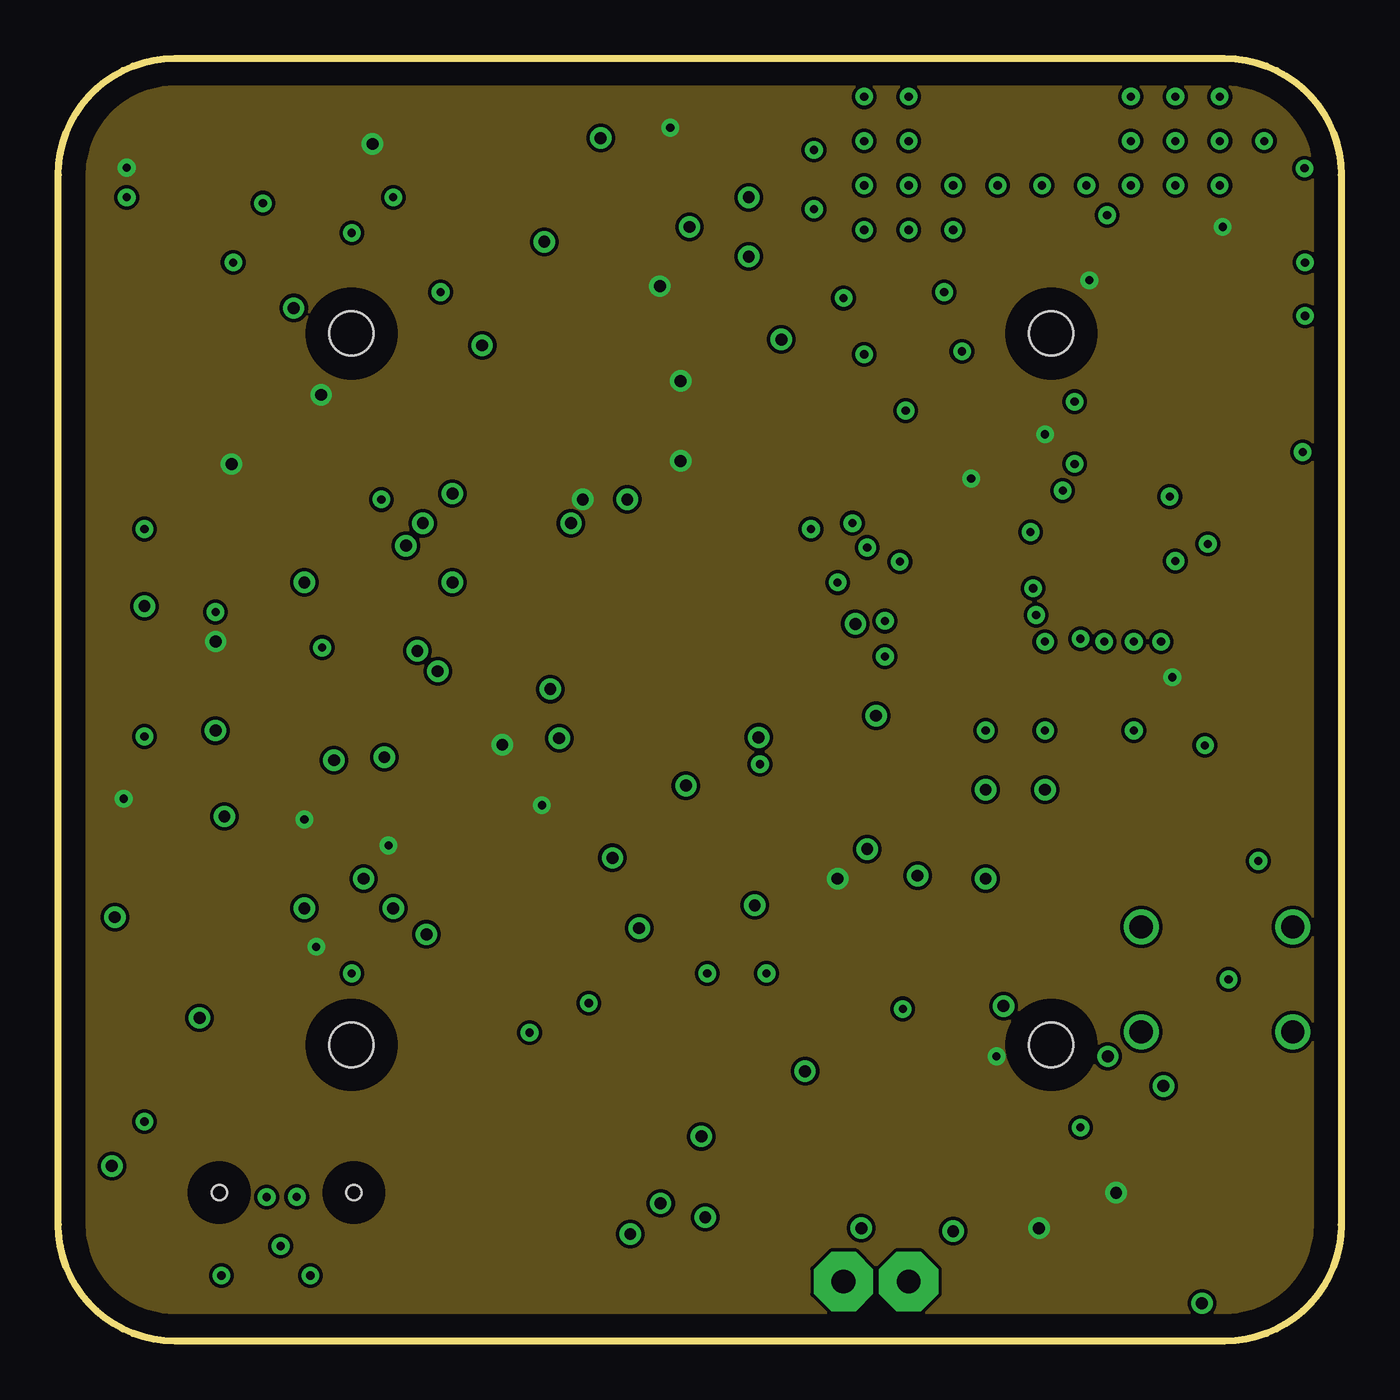
[diagram p8: board, inner layer Route15]
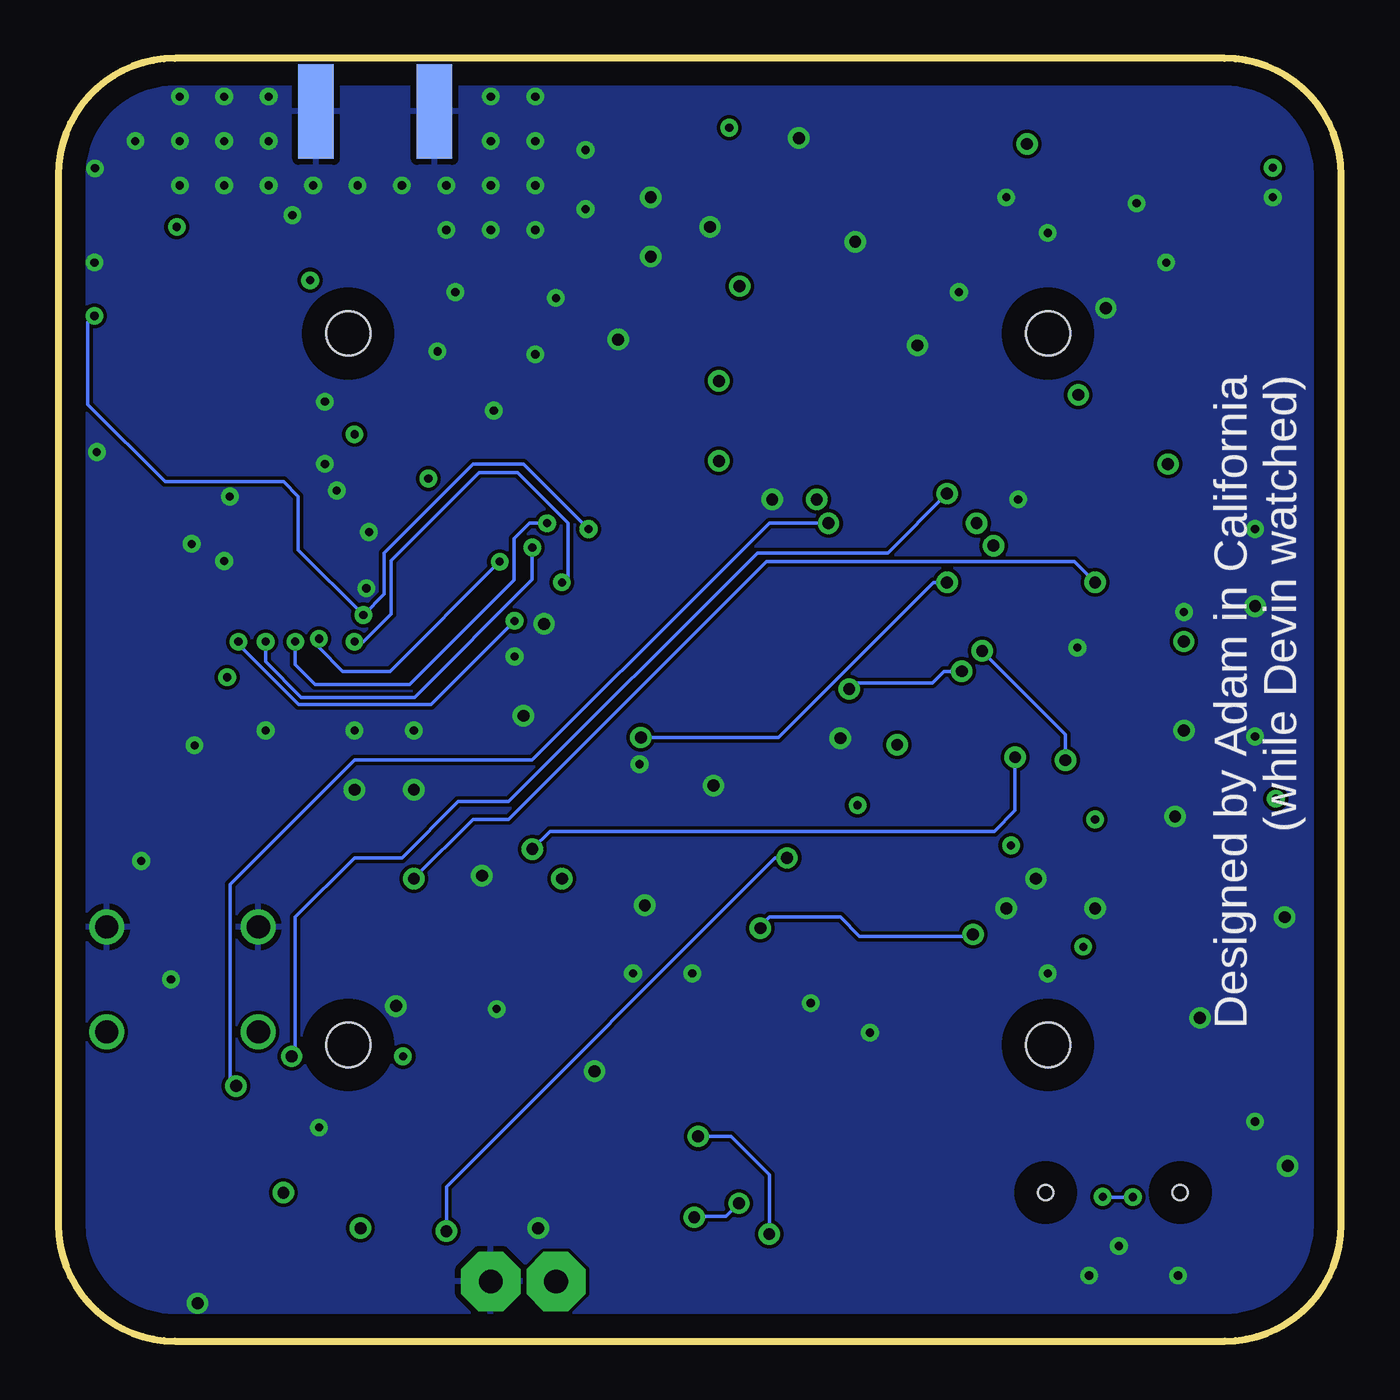
[diagram p9: board, bottom side, seen from below]

Size 55 x 55 mm. Coordinates in mm from the lower left corner, seen from the top.
Outline: 50,0 5,0 arc-90 0,5 0,50 arc-90 5,55 50,55 arc-90 55,50 55,5 arc-90 50,0
Copper layers (1+2*15+16): Top 0.035mm / dielectric 0.2mm / Route2 0.0175mm / dielectric 1.065mm / Route15 0.0175mm / dielectric 0.2mm / Bottom 0.035mm
Design rules "default *": minimum track width 6mil, minimum drill 0.35mm, track to track 6mil, track to pad 6mil, pad to pad 6mil, via to via 6mil, smd to smd 6mil, copper to edge 40mil, drill to drill 6mil, minimum pad ring 10mil, minimum via ring 8mil, stop-mask expansion 2mil, vias tented up to drill 0mil, thermal gap 10mil
Holes 1.91 mm at 42.57,12.7 12.57,12.7 12.57,43.2 42.57,43.2

### Footprints (pad centres in the part's own frame; a part is rotated, then mirrored left to right if it is on the bottom)
B2,54 = smd 2.54 x 2.54: TP 0,0
C0402 = smd 0.7 x 0.9: 1 -0.65,0; 2 0.65,0
0603 = smd 1.1 x 1: 1 -0.85,0; 2 0.85,0
0603-CAP = smd 1.1 x 1: 1 -0.85,0; 2 0.85,0
B1,27 = smd 1.27 x 1.27: TP 0,0
EVERLIGHT_EAST1616RGBB2_0 = smd 0.8 x 0.55: 1 -0.8,-0.45; 2 -0.8,0.45; 3 0.8,0.45; 4 0.8,-0.45
VISHAY_SSB43L-E3-52T_0 = smd 1.716 x 2.18: 1 -1.937,0; 2 1.937,0
DIODE_0603 = smd 1.1 x 1: A 0.85,0; C -0.85,0
SMD1,27-2,54 = smd 1.27 x 2.54: 1 0,0
2,54/1,0 = drill 1.016 pad 2.54 octagon: 1 0,0
PUSH_BUTTON = drill 1: 1 -4,-2; 2 2.5,-2; 3 -4,2.5; 4 2.5,2.5
GCT_USB4110-GF-A = smd 0.6 x 1.15: A1/B12 -3.2,1.075; A4/B9 -2.4,1.075; B1/A12 3.2,1.075; B4/A9 2.4,1.075 | smd 0.3 x 1.15: A5 -1.25,1.075; A6 -0.25,1.075; A7 0.25,1.075; A8 1.25,1.075; B5 1.75,1.075; B6 0.75,1.075; B7 -0.75,1.075; B8 -1.75,1.075 | smd 2.18 x 2: S1 -5.11,0.5; S2 5.11,0.5; S3 -5.11,-3.43; S4 5.11,-3.43 | hole 0.65: -2.89,0; 2.89,0
SMA-EDGE = smd 1.524 x 4.064: GND@0 0,0; GND@1 5.08,0; SIG 2.54,0 | smd 1.524 x 4.064 bottom: GND@2 0,0; GND@3 5.08,0
SMT-JUMPER_2_NC_TRACE_SILK = smd 0.66 x 1.27: 1 -0.521,0; 2 0.521,0
REG_INDUCTOR = smd 1.9 x 5.1: @1 -3,0; @2 1.1,0
CHIPLED_1206 = smd 1.5 x 1.5: A 0,-1.75; C 0,1.75
JTAG-10MINI = smd 0.64 x 2.54: 1 -2.413,-1.905; 2 -2.413,1.905; 3 -1.143,-1.905; 4 -1.143,1.905; 5 0.127,-1.905; 6 0.127,1.905; 7 1.397,-1.905; 8 1.397,1.905; 9 2.667,-1.905; 10 2.667,1.905
SOT-23 = smd 0.802 x 0.972: P1 -0.95,-0.917; P2 0.95,-0.917; P3 0,0.917
SOT-416FL = smd 0.46 x 0.65: 1 -0.5,-1.1; 2 0.5,-1.1; 3 0,0.05
QFN20 = smd 1 x 1: 0 0,0 | smd 0.65 x 0.3: 1 -1.9,1; 2 -1.9,0.5; 3 -1.9,0; 4 -1.9,-0.5; 5 -1.9,-1; 11 1.9,-1; 12 1.9,-0.5; 13 1.9,0; 14 1.9,0.5; 15 1.9,1 | smd 0.3 x 0.65: 6 -1,-1.9; 7 -0.5,-1.9; 8 0,-1.9; 9 0.5,-1.9; 10 1,-1.9; 16 1,1.9; 17 0.5,1.9; 18 0,1.9; 19 -0.5,1.9; 20 -1,1.9
TEXAS_INSTRUMENTS_TLC59731DR_0 = smd 1.55 x 0.6: 1 -2.7,1.905; 2 -2.7,0.635; 3 -2.7,-0.635; 4 -2.7,-1.905; 5 2.7,-1.905; 6 2.7,-0.635; 7 2.7,0.635; 8 2.7,1.905 | smd 1.5 x 0.55: SMD_9 -2.7,1.905; SMD_10 -2.7,0.635; SMD_11 -2.7,-0.635; SMD_12 -2.7,-1.905; SMD_13 2.7,1.905; SMD_14 2.7,0.635; SMD_15 2.7,-0.635; SMD_16 2.7,-1.905
QFN50P500X500X90-33N = smd 0.81 x 0.27: 1 -2.45,1.75; 2 -2.45,1.25; 3 -2.45,0.75; 4 -2.45,0.25; 5 -2.45,-0.25; 6 -2.45,-0.75; 7 -2.45,-1.25; 8 -2.45,-1.75; 17 2.45,-1.75; 18 2.45,-1.25; 19 2.45,-0.75; 20 2.45,-0.25; 21 2.45,0.25; 22 2.45,0.75; 23 2.45,1.25; 24 2.45,1.75 | smd 0.27 x 0.81: 9 -1.75,-2.45; 10 -1.25,-2.45; 11 -0.75,-2.45; 12 -0.25,-2.45; 13 0.25,-2.45; 14 0.75,-2.45; 15 1.25,-2.45; 16 1.75,-2.45; 25 1.75,2.45; 26 1.25,2.45; 27 0.75,2.45; 28 0.25,2.45; 29 -0.25,2.45; 30 -0.75,2.45; 31 -1.25,2.45; 32 -1.75,2.45 | smd 3.4 x 3.4: 33 0,0
WSON = smd 0.45 x 0.3: 1 -1.02,0.59; 2 -1.02,-0.03; 3 -1.02,-0.7; 4 0.94,-0.7; 5 0.94,-0.03; 6 0.94,0.59 | smd 1 x 1.6: 7 0,-0.05
SOIC127P600X175-9N = smd 1.97 x 0.6: 1 -2.475,1.905; 2 -2.475,0.635; 3 -2.475,-0.635; 4 -2.475,-1.905; 5 2.475,-1.905; 6 2.475,-0.635; 7 2.475,0.635; 8 2.475,1.905 | smd 2.29 x 2.29: 9 0,0
QFN50P300X300X60-17N = smd 0.81 x 0.27: 1 -1.445,0.75; 2 -1.445,0.25; 3 -1.445,-0.25; 4 -1.445,-0.75; 9 1.445,-0.75; 10 1.445,-0.25; 11 1.445,0.25; 12 1.445,0.75 | smd 0.27 x 0.81: 5 -0.75,-1.445; 6 -0.25,-1.445; 7 0.25,-1.445; 8 0.75,-1.445; 13 0.75,1.445; 14 0.25,1.445; 15 -0.25,1.445; 16 -0.75,1.445 | smd 1.7 x 1.7: 17 0,0
LGA8 = smd 1.9 x 0.6: P$1 -1.5,1.875; P$2 -1.5,0.625; P$3 -1.5,-0.625; P$4 -1.5,-1.875; P$5 1.5,-1.875; P$6 1.5,-0.625; P$7 1.5,0.625; P$8 1.5,1.875
QFP50P1200X1200X160-64N = smd 1.47 x 0.28: 1 -5.67,3.75; 2 -5.67,3.25; 3 -5.67,2.75; 4 -5.67,2.25; 5 -5.67,1.75; 6 -5.67,1.25; 7 -5.67,0.75; 8 -5.67,0.25; 9 -5.67,-0.25; 10 -5.67,-0.75; 11 -5.67,-1.25; 12 -5.67,-1.75; 13 -5.67,-2.25; 14 -5.67,-2.75; 15 -5.67,-3.25; 16 -5.67,-3.75; 33 5.67,-3.75; 34 5.67,-3.25; 35 5.67,-2.75; 36 5.67,-2.25; 37 5.67,-1.75; 38 5.67,-1.25; 39 5.67,-0.75; 40 5.67,-0.25; 41 5.67,0.25; 42 5.67,0.75; 43 5.67,1.25; 44 5.67,1.75; 45 5.67,2.25; 46 5.67,2.75; 47 5.67,3.25; 48 5.67,3.75 | smd 0.28 x 1.47: 17 -3.75,-5.67; 18 -3.25,-5.67; 19 -2.75,-5.67; 20 -2.25,-5.67; 21 -1.75,-5.67; 22 -1.25,-5.67; 23 -0.75,-5.67; 24 -0.25,-5.67; 25 0.25,-5.67; 26 0.75,-5.67; 27 1.25,-5.67; 28 1.75,-5.67; 29 2.25,-5.67; 30 2.75,-5.67; 31 3.25,-5.67; 32 3.75,-5.67; 49 3.75,5.67; 50 3.25,5.67; 51 2.75,5.67; 52 2.25,5.67; 53 1.75,5.67; 54 1.25,5.67; 55 0.75,5.67; 56 0.25,5.67; 57 -0.25,5.67; 58 -0.75,5.67; 59 -1.25,5.67; 60 -1.75,5.67; 61 -2.25,5.67; 62 -2.75,5.67; 63 -3.25,5.67; 64 -3.75,5.67
QFN40P300X300X105-24N = smd 0.64 x 0.22: 1 -1.545,1; 2 -1.545,0.6; 3 -1.545,0.2; 4 -1.545,-0.2; 5 -1.545,-0.6; 6 -1.545,-1; 13 1.545,-1; 14 1.545,-0.6; 15 1.545,-0.2; 16 1.545,0.2; 17 1.545,0.6; 18 1.545,1 | smd 0.22 x 0.64: 7 -1,-1.545; 8 -0.6,-1.545; 9 -0.2,-1.545; 10 0.2,-1.545; 11 0.6,-1.545; 12 1,-1.545; 19 1,1.545; 20 0.6,1.545; 21 0.2,1.545; 22 -0.2,1.545; 23 -0.6,1.545; 24 -1,1.545
ICCAF50P160X80X70-6N = smd 0.69 x 0.19: 1 -0.57,0.5; 2 -0.57,0; 3 -0.57,-0.5; 4 0.57,-0.5; 5 0.57,0; 6 0.57,0.5
NDK-NX3225GD = smd 1.5 x 2.7: 1 -0.95,0; 2 0.95,0
NDK_NX3215SA-32.768K-STD-MUA-8_0 = smd 1 x 1.8: 1 -1.25,0; 2 1.25,0
OSCSC320X250X100N = smd 0.98 x 1.1: 1 -0.85,1.1; 2 -0.85,-1.1; 3 0.85,-1.1; 4 0.85,1.1

### Placement (x,y rotation side)
1.8V  39.25,2.56 270 top
3V3  42.05,2.56 0 top
5V  44.84,2.56 0 top
C1  52.08,26.94 180 top
C2  52.08,34.94 0 top
C3  39.76,33.93 180 top
C4  49.41,38.5 270 top
C5  52.08,36.72 0 top
C6  47.63,41.8 90 top
C7  45.86,41.8 90 top
C8  4.96,32.53 270 top
C9  2.42,32.53 270 top
C10  4.71,44.47 90 top
C11  2.17,44.47 90 top
C12  26.93,35.7 180 top
C13  24.39,38.25 270 top
C14  15.88,23.64 90 top
C15  32.65,26.69 0 top
C16  32.65,29.23 0 top
C17  41.79,15.77 0 top
C18  22.74,16.91 180 top
C19  29.47,7.38 180 top
C20  35.44,17.8 90 top
C21  37.98,17.8 90 top
C22  30.74,20.59 180 top
C23  22.74,19.32 180 top
C24  2.3,20.85 270 top
C25  21.98,38.25 270 top
C26  18.04,23.64 90 top
C27  9.91,41.55 270 top
C28  8.65,23.64 90 top
C29  39.76,40.15 180 top
C30  49.16,27.96 270 top
C31  39.76,35.7 180 top
C32  43.7,47.64 270 top
C33  52.46,47.26 180 top
C34  52.46,49.04 180 top
CE  33.79,37.86 0 top
D1  11.06,52.09 0 top
D2  20.84,4.34 180 top
D3  18.17,10.18 270 top
D4  20.96,10.18 270 top
ESC1  27.82,3.07 180 top
ESC2  3.31,29.23 90 top
ESC3  28.84,52.09 180 top
ESC4  52.33,24.66 90 top
GND  36.46,2.56 0 top
IRQ  40.78,29.99 0 top
J1  50.43,15.26 0 top
J2  9.79,6.37 0 top
J3  38.87,52.72 0 top
JP1  13.22,9.8 90 top
L1  47.63,38.5 270 top
L2  49.41,41.8 90 top
L3  45.86,38.5 90 top
L4  37.09,13.15 0 top
LED1  5.98,52.09 270 top
MISO  36.46,34.82 0 top
MOSI  34.93,36.34 0 top
P1  49.92,6.11 0 top
Q2  17.41,15.26 0 top
Q3  18.42,19.32 90 top
Q6  22.95,26.03 90 top
R1  49.16,31.39 90 top
R2  39.76,38.37 180 top
R3  21.47,43.2 90 top
R4  24.01,43.2 90 top
R5  16.52,41.55 270 top
R6  5.98,49.29 0 top
R7  25.92,7.38 180 top
R8  10.3,10.43 270 top
R9  41.79,18.05 180 top
R10  15.12,10.18 90 top
R11  5.85,11.07 270 top
R12  25.79,22.5 180 top
R13  22.01,24.35 180 top
R14  29.22,30.88 0 top
R15  52.46,42.31 180 top
R16  52.46,45.23 0 top
R17  16.42,20.62 180 top
SCK  37.86,33.17 0 top
SS  39.38,31.51 0 top
TP9  23.76,49.55 0 top
U1  44.84,33.55 90 top
U2  18.68,50.82 0 top
U3  6.87,18.18 0 top
U4  26.93,19.19 0 top
U5  27.57,11.45 0 top
U6  47,46.5 90 top
U7  30.11,39.39 0 top
U8  13.96,32.78 0 top
U9  27.51,27.72 0 top
U10  41.41,47.64 90 top
USB_VCC  2.55,13.35 0 top
VBAT  33.66,2.56 0 top
X1  3.69,37.36 0 top
X2  3.69,40.53 0 top
X3  52.08,31.26 180 top

### Tracks (layer width: path | path; a pad name or v marks a point on that pad's centre or on a via)
1V8  (via drill 0.51)
  Top 0.152: U4.1 24.03,19.78 23.66,19.42 23.68,19.41 C23.1 23.59,20.55 v23.76,20.72 | U4.1 24.94,20.76 R12.2 23.54,22.5 19.87,18.82 Q3.1 19.48,18.82 18.96,19.35 18.96,20.19 19.27,20.5 20.61,20.5 23.91,23.8 24.55,23.8 24.73,23.98 24.73,25.32 24.52,25.53 Q6.1 | 28.33,22.37 28.33,23.49 26.91,24.91 U9.8 26.91,26.73 | 28.33,22.37 28.33,22.28 25.91,19.86 U4.1 | 31.8,29.15 C16.1 31.8,29.01 29.51,26.72 U9.13 28.99,26.79 28.66,26.79 28.56,26.88 27.06,26.88 26.91,26.73 | U9.22 27.25,29.21 27.25,28.87 26.97,28.59 26.55,28.59 26.55,26.95 26.63,26.88 26.76,26.88 26.91,26.73 | R14.2 31.8,29.15 | 31.8,29.15 31.8,28.43 32.01,28.21 35.57,28.21 35.82,27.96 35.82,25.29 35.44,24.91 34.68,24.91 32.14,22.37 28.33,22.37 | 1.8V.TP 38.36,3.45 v38.36,4.72
  Bottom 0.152: v23.76,20.72 24.27,20.72 38.36,6.62 v38.36,4.72
5V_BAT
  Top 0.254: VBAT.1 32.4,1.3 21.98,1.3 20.96,2.31 D4.A
+3V3  (via drill 0.35, 0.51)
  Top 0.152: U8.64 10.21,40.4 C27.2 11.15,40.7 v11.27,40.57 | 38.41,17.37 C21.1 38.07,16.86 | 38.41,17.37 39.09,18.05 R9.2 | 38.41,17.37 35.87,17.37 C20.1 34.53,17.86 32.24,17.86 | U8.48 21.12,36.53 C25.2 22.49,36.89 v22.49,36.09 | U3.1 2.65,21.7 C24.1 2.3,22.75 v2.8,23.26 | v10.55,22.37 10.55,22.58 C28.2 10.3,26.15 10.92,26.15 11.21,26.44 U8.19 | U8.32 18.04,26.78 C26.2 19.03,25.48 v19.03,25.57 | U2.8 25.54,52.72 v26.23,52.02 | U4.6 27.92,19.74 30.36,19.74 | 30.36,19.74 30.41,19.74 31.27,20.59 C22.1 32.36,19.83 v33.41,19.83 | 30.36,19.74 32.24,17.86 | U4.4 28.51,17.86 32.24,17.86 | U3.19 10.41,17.43 10.93,16.91 v11.06,16.91 | U8.1 7.35,37.48 7.35,37.61 v7.42,37.61 v7.43,37.61 | U8.13 7.61,30.53 7.07,29.99 v6.74,29.99 v6.75,30 | R3.2 R4.2 24.61,44.05 v25.79,45.23 | C12.1 27.78,37.51 U7.P$4 26.9,37.51 v26.68,37.74 | v13.47,51.33 13.16,51.64 D1.4 | v26.68,41.17 26.78,41.26 U7.P$1 | 3V3.TP v42.05,4.84 | P1.1 v45.35,6.37 | C29.1 40.79,40.15 41.43,39.52 | U1.15 42.7,35.45 41.43,36.72 41.43,39.52 | U1.7 47.24,33.05 47.89,32.4 47.89,29.48 48.76,28.61 C30.1 47.9,28.61 v47.76,28.47 | v39.12,36.99 v39.13,36.98 C31.1 41.07,35.04 41.07,34.01 41.54,33.55 U1.18 | v2.93,50.31 2.93,50.79 LED1.A | 41.43,39.52 42.06,38.88 v42.3,38.88 | C33.2 51.3,47.77 | 51.3,47.77 v49.92,47.77 | C34.2 51.81,48.28 51.3,47.77 | U6.14 45.08,46.74 44.2,45.86 v44.2,45.48 45.29,45.48 U6.16 | R13.2 21.16,23.4 v20.73,22.98 | R17.2 14.79,20.62 v14.16,21.25
  Top 0.61: U5.5 35.22,9.54 36.69,11.02 36.69,12.49 37.35,13.15 L4.@2 | C21.1 37.98,15.26 38.49,14.75 38.49,13.45 L4.@2 | L4.@2 39.13,12.21 v40.22,12.21
  pour Route15: -1.64,-1.25 56.4,-1.25 56.4,55.9 -1.64,55.9
+5V  (via drill 0.51)
  Top 0.152: Q2.P3 16.6,16.99 16.14,17.44 v15.78,17.44 | v24.9,17.7 24.39,17.7 C18.1 | R7.1 25.82,6.44 v25.82,5.91 | v27.73,5.31 28.28,5.86 43.57,5.86 44.84,4.59 5V.TP
  Top 0.2: U5.3 25.79,10.12 25.79,10.09 26.18,10.09 26.33,9.95 26.33,7.82 R7.1
  Top 0.254: C18.1 26.36,14.14 26.36,12.94 25.79,12.37 25.79,12.21 25.66,12.08 U5.2 U5.3 | D3.C 17.41,11.79 Q2.P3
  Bottom 0.152: v25.82,5.91 26.38,5.35 27.7,5.35 v27.73,5.31 | v24.9,17.7 24.9,17.8 24.52,18.18 21.47,18.18 20.65,17.35 15.87,17.35 v15.78,17.44
ALT_IRQ_1
  Top 0.152: U8.42 25.14,33.53 25.87,34.26 29.93,34.26 32.79,37.12 32.79,37.91 32.14,38.55 32.14,38.88 31.73,38.88 U7.P$6
ALT_IRQ_2
  Top 0.152: U8.43 25.14,34.03 25.66,34.56 29.6,34.56 31.61,36.57 U7.P$5
CAP
  Top 0.152: C13.1 25.31,40.01 U7.P$2
GND  (via drill 0.35, 0.51)
  Top 0.152: U2.7 21.51,51.58 v23.25,51.58 | U8.18 10.71,27.92 10.42,28.21 8.77,28.21 v6.74,26.18 | C24.2 3.86,18.43 | 3.86,18.43 U3.4 | C28.1 8.35,22.5 v7.12,22.5 | U3.33 7.12,17.93 U3.20 9.67,17.94 10.29,18.56 v10.55,18.56 | U4.5 29.38,19.17 v29.85,18.69 | J2.S1 5.59,7.78 6.31,7.78 5.39,6.87 J2.S1 | R11.1 6.05,12.12 v6.05,13.86 | J2.S1 2.94,6.87 v2.3,7.51 | C16.2 33.5,30.08 v34.17,30.75 | C15.2 34.93,26.69 v35.06,26.81 | C21.2 36.84,19.79 | 36.84,19.79 v36.84,19.96 | C20.2 36.59,19.79 36.84,19.79 | C17.1 40.94,14.79 v40.52,14.37 | P1.3 48.78,1.88 49.01,1.65 | 49.01,1.65 v49.03,1.63 | P1.5 50.05,2.69 49.01,1.65 | P1.9 52.59,2.43 51.98,1.82 51.88,1.75 51.66,1.65 49.01,1.65 | GND.1 36.46,4.21 35.82,4.84 v34.43,4.84 | U5.7 31.5,12.08 v32.01,11.58 | C13.2 v24.39,36.09 25.7,36.09 C12.2 | R5.1 16.81,42.69 v18.17,42.69 | C27.1 9.91,44.12 v10.09,44.29 | U8.12 6.97,31.03 v6.74,31.26 | 3.86,18.43 2.67,18.43 v2.42,18.18 | C9.2 3.53,31.68 v3.69,31.51 | C4.2 49.32,37.85 47.68,36.21 v47.64,36.21 v47.64,36.2 v47.65,36.21 | U1.17 42.3,34.05 41.68,34.67 v41.68,34.69 | v2.93,49.04 3.18,49.29 R6.1 | C34.1 53.43,49.36 v53.43,50.28 | C33.1 53.45,46.92 v53.45,46.25 | v53.35,38.12 53.35,37.34 C5.2 C2.2 | U1.8 47.79,33.55 v47.89,33.44 | U6.2 46.75,46.38 46.87,46.5 46.87,47.82 U6.11 | U6.3 47.25,46.25 U6.17 47.75,47.25 U6.8 | U2.4 14.49,48.91 v14.36,49.04 | C30.2 v49.16,25.55 | U9.11 28.17,26.12 28.17,25.78 29.22,24.73 v30.08,24.73
  other vias: 13.09,19.83 14.36,18.56 42.3,23.64 39.76,23.64 27.06,47.77 29.6,49.04 29.6,46.5 44.97,48.28 36.46,53.36 36.46,51.45 36.46,49.55 38.36,49.55 40.27,49.55 42.17,49.55 44.08,49.55 45.98,49.55 45.98,51.45 45.98,53.36 34.55,53.36 34.55,51.45 34.55,49.55 34.55,47.64 36.46,47.64 38.36,47.64 47.89,53.36 47.89,51.45 47.89,49.55 49.79,49.55 49.79,51.45 49.79,53.36 51.7,51.45 49.28,34.18 43.57,37.61 41.79,32.28 43.06,36.47 46.11,26.18 39.76,26.18 35.44,29.36 36.33,39.9 38.74,42.44 34.55,42.31 43.57,40.28 37.98,44.98 11.31,29.74 13.85,36.09 16.39,44.98 8.77,48.79 12.58,47.52 7.5,46.25 3.69,34.82 3.69,25.93 3.69,9.42 12.58,15.77 22.74,14.5 20.2,13.23 30.36,15.77 27.82,15.77 36.2,14.24 43.82,9.16 50.17,15.51 51.44,20.59 33.66,44.72 32.39,48.53 32.39,51.07 9.53,4.08 10.8,2.81 6.99,2.81 31,42.94 20.84,47.13 26.91,23.82 42.3,26.18 21.47,25.85
  pour Route2: -0.37,55.9 -0.37,-1.12 56.27,-1.12 56.27,55.9
  pour Bottom: -2.15,55.39 -2.15,-0.49 56.27,-0.49 56.27,55.39
  pour Top: -2.15,55.39 -2.15,-0.49 56.27,-0.49 56.27,55.39
IMU_IRQ  (via drill 0.51)
  Top 0.152: U8.41 18.57,33.03 18.07,32.53 v16.9,32.53 | U9.12 29.73,26.18 v30.02,25.88
  Bottom 0.152: v16.9,32.53 17.49,32.53 24.14,25.88 v30.02,25.88
LED_SDO  (via drill 0.51)
  Top 0.152: TP9.TP 23.12,50.18 U2.6 21.85,50.18 23,49.04 23,47.52 21.47,45.99 9.53,45.99 8.52,44.98 8.52,38.37 10.71,36.18 10.71,34.83 15.2,30.33 15.2,29.79 v15.4,29.6 | U8.21 12.21,26.43 11.82,26.05 v11.82,24.91
  Bottom 0.152: v15.4,29.6 11.82,26.02 v11.82,24.91
MOTOR1
  Top 0.152: U8.22 12.71,25.16 12.71,22.6 13.29,22.01 13.29,21 16.18,18.11 17.19,18.11 23.25,12.06 23.25,7 27.19,3.07 ESC1.1
MOTOR2
  Top 0.2: ESC2.1 6.05,29.23 6.63,28.64 12.39,28.64 13.21,27.83 U8.23
MOTOR3
  Top 0.152: U8.26 14.71,30.19 10.4,34.5 10.4,35.6 8.01,37.99 8.01,45.23 9.28,46.5 17.28,46.5 18.8,48.02 18.8,52.85 19.71,53.76 27.17,53.76 ESC3.1
MOTOR4  (via drill 0.51)
  Top 0.152: U8.27 15.21,26.27 v13.98,25.04 | v34.68,21.1 42.71,21.1 43.32,21.71 49.38,21.71 ESC4.1
  Bottom 0.152: v13.98,25.04 13.98,22.75 14.87,21.86 33.92,21.86 v34.68,21.1
N$1
  Top 0.152: U1.9 48.3,34.05 48.65,33.7 48.65,33.04 48.27,32.66 48.27,31.12 48.65,30.74 R1.1 49.17,30.75 50.17,30.75 50.43,31.01 52.08,31.01 X3.1 53.18,29.91 53.18,28.67 52.73,28.21 C1.1
N$2
  Top 0.152: U1.10 47.25,35.05 51.32,35.05 C2.1 51.43,32.56 X3.3 50.91,32.04 R1.2
N$3
  Top 0.152: L2.2 48.65,41.69 48.65,40.17 L1.1 48.44,38.34 48.44,37.4 48.18,37.14 47.73,37.14 46.67,36.09 45.65,36.09 45.34,35.77 U1.12
N$4
  Top 0.152: R2.1 40.41,37.27 42.94,34.74 U1.16
N$5
  Top 0.152: C3.1 41.29,33.05 U1.19
N$6
  Top 0.152: L3.1 45.86,37.61 | 45.86,37.61 45.86,36.96 44.84,35.94 U1.13 | 45.86,37.61 46.09,37.85 L1.2
N$7
  Top 0.152: R8.2 11.54,8.34 J2.B5
N$8
  Top 0.152: C9.1 2.74,33.7 X1.1 2.74,37.75 3.93,38.94 5.54,38.94 5.72,38.75 5.72,34.94 6.13,34.53 U8.5
N$9
  Top 0.152: C7.1 L3.2
N$10
  Top 0.152: C8.1 4.64,33.7 X1.2 5.29,36.7 5.29,34.7 5.96,34.03 U8.6
N$11
  Top 0.152: D1.1 11.59,50.31 14.36,50.31 14.49,50.18 U2.3
N$12
  Top 0.152: D1.3 12.04,52.72 U2.1
N$13
  Top 0.152: U8.3 6.91,35.53 6.74,35.7 6.74,45.23 5.6,46.37 4.07,46.37 3.44,45.74 3.44,41.53 X2.1 2.44,41.15 2.17,41.42 C11.1
N$14
  Top 0.152: U8.4 6.4,35.03 6.23,35.2 6.23,39.24 X2.2 4.94,43.38 C10.1
N$16
  Top 0.152: R5.2 15.82,40 12.7,40 12.21,39.51 U8.60
N$17
  Top 0.152: U8.30 16.71,25.32 C14.2
N$20
  Top 0.152: C19.1 30.32,6.71 29.85,6.24 27.7,6.24 26.68,5.22 25.54,5.22 23.63,7.13 23.63,12.97 24.01,13.35 U5.1
N$23
  Top 0.2: R7.2 25.07,9.52 U5.4
N$24  (via drill 0.51)
  Top 0.152: D2.1 24.27,4.34 v24.52,4.59 | C19.2 27.57,8.44 v27.57,8.78
  Top 0.254: C19.2 28.62,9.8 28.95,10.13 32.01,10.13 34.09,12.21 L4.@1
  Top 0.305: U5.8 33.89,13.35
  Top 0.61: 33.66,13.35 33.89,13.35 L4.@1
  Bottom 0.152: v27.57,8.78 26.17,8.78 24.52,7.13 v24.52,4.59
N$25
  Top 0.152: LED1.C 7.73,50.19 R6.2
N$26
  Top 0.152: J2.A5 8.54,8.01 6.33,10.22 R11.2 6.08,10.22 6.08,9.97
N$27
  Top 0.152: D1.2 10.76,53.04 14.3,53.04 14.99,53.74 16.9,53.74 17.41,53.23 17.41,51.96 16.9,51.45 U2.2
N$34
  Top 0.254: D4.C 18.36,13.63 Q2.P2
N$37
  Top 0.152: U6.10 47.24,48.68 47.01,48.91 44.32,48.91 C32.1 42.81,47.4 42.81,46.37 42.55,46.12 41.66,46.12 41.41,46.37 U10.2
N$39
  Top 0.152: U9.10 27.71,25.53 29.6,23.64 30.87,23.64 31.71,24.48 31.71,26.61 C15.1
N$53
  Top 0.152: J3.SIG U10.5
N$57
  Top 0.152: U6.6 48.45,46.24 48.92,46.24 49.94,45.23 R16.1
N$58
  Top 0.152: R15.1 53.11,43.07 52.22,43.96 50.23,43.96 U6.5
NRST  (via drill 0.51)
  Top 0.152: P1.10 52.93,8.36 J1.2 J1.1 45.15,13.26 C17.2 R9.1 40.86,19.83 v39.76,19.83 | U8.7 9.55,33.53 v10.55,32.53
  Bottom 0.152: v10.55,32.53 11.44,33.42 24.65,33.42 35.7,22.37 37.22,22.37 v39.76,19.83
RF_CE  (via drill 0.35, 0.51)
  Top 0.152: v15.63,35.07 15.63,32.83 17.42,31.04 19.5,31.04 19.5,31.03 U8.37 20.52,31.03 22.68,33.19 25.44,33.19 26.17,33.93 31.38,33.93 v32.27,34.82 33.79,36.34 CE.TP | v41.92,31.13 42.43,31.65 U1.1 | v53.45,43.96 53.45,44.89 R16.2
  Bottom 0.152: v32.27,34.82 35.06,37.61 37.22,37.61 41.03,33.8 41.03,32.02 v41.92,31.13 44.71,33.93 44.71,36.21 45.35,36.85 50.43,36.85 53.73,40.15 53.73,43.68 v53.45,43.96
RF_IRQ  (via drill 0.35, 0.51)
  Top 0.152: U8.29 16.21,28.67 v16.27,28.72 | v21.09,27.96 21.09,28.59 23.83,31.34 26.93,31.34 27.72,32.12 31.53,32.12 31.76,31.89 34.43,31.89 v35.44,30.88 35.52,30.8 38.01,30.8 38.83,29.99 IRQ.TP | v47.28,29.99 47.28,32 U1.6
  Bottom 0.152: v16.27,28.72 17.03,28.72 17.53,28.21 20.84,28.21 v21.09,27.96 | v47.28,29.99 47.4,29.99 44.71,27.3 39.02,27.3 v35.44,30.88
RF_MISO  (via drill 0.35)
  Top 0.152: U8.35 20.75,30.03 23.07,32.35 25.93,32.35 26.77,33.19 32.37,33.19 32.9,33.72 34.38,33.72 v34.68,34.03 35.47,34.82 MISO.TP | v46.11,29.99 45.84,30.26 U1.5
  Bottom 0.152: v34.68,34.03 34.68,32.66 39.73,27.6 44.58,27.6 46.11,29.13 v46.11,29.99
RF_MOSI  (via drill 0.35, 0.51)
  Top 0.152: v14.9,34.11 15.33,33.68 15.33,32.7 17.49,30.53 U8.36 20.62,30.53 22.87,32.78 25.66,32.78 26.37,33.5 32.24,33.5 32.78,34.03 33,34.03 v34.05,35.07 34.93,35.96 MOSI.TP | U1.4 45.35,30.46 44.87,29.99 v44.84,29.99
  Bottom 0.152: v34.05,35.07 34.81,35.07 35.47,34.41 35.47,32.63 39.94,28.16 44,28.16 44.84,29 v44.84,29.99
RF_SCK  (via drill 0.35)
  Top 0.152: U8.34 20.82,29.54 23.3,32.02 26.3,32.02 27.06,32.78 32.39,32.78 33.03,33.42 v36.08,33.42 37.6,33.42 SCK.TP | U1.3 44.85,30.97 43.99,30.12 v43.82,30.12
  Bottom 0.152: v43.82,30.12 43.82,29.74 42.81,28.72 40.78,28.72 v36.08,33.42
RF_SS  (via drill 0.35)
  Top 0.152: U8.33 20.9,29.03 23.5,31.64 26.68,31.64 27.52,32.48 33.36,32.48 v33.41,32.53 35.22,32.53 36.59,31.16 39.02,31.16 SS.TP | U1.2 44.35,31.35 44,31.01 43.32,31.01 v42.3,29.99
  Bottom 0.152: v33.41,32.53 33.16,32.78 33.16,35.07 35.31,37.23 36.97,37.23 40.73,33.47 40.73,31.18 41.92,29.99 v42.3,29.99
SENSOR_SCL
  Top 0.152: U7.P$8 31.61,41.34 29.87,43.08 26.68,43.08 25.02,41.42 22.4,41.42 R3.1 21.37,42.35 20.14,43.58 15.25,43.58 15.12,43.45 15.12,41.94 13.49,40.31 12.5,40.31 11.71,39.52 U8.61 11.69,38.44 11.69,35.2 19.44,27.45 20.63,27.45 20.81,27.27 21.65,27.27 Q6.3 22.85,25.99 R13.1
SENSOR_SCL_LV
  Top 0.152: Q6.2 23.25,27.32 23.25,28.72 24.77,30.24 26.27,30.24 | U9.23 26.85,29.33 26.85,29.67 26.27,30.24 | R14.1 27.73,30.24 26.27,30.24
SENSOR_SDA
  Top 0.152: U7.P$7 32.51,40.01 33.03,40.53 33.03,42.18 31.25,43.96 25.62,43.96 R4.1 23.16,43.2 20.95,43.2 20.19,43.96 15.12,43.96 14.74,43.58 14.74,41.98 13.41,40.66 12.33,40.66 11.21,39.54 U8.62 11.21,35 18.48,27.74 18.48,27.45 19.59,26.33 19.59,25.98 19.72,25.85 19.72,21.38 18.37,20.03 18.37,19.83 | R17.1 17.59,20.62 18.27,19.93 18.37,19.83 | 18.37,19.83 Q3.3
SENSOR_SDA_LV
  Top 0.152: U9.24 25.24,29.27 25.23,29.27 24.6,28.64 24.6,27.45 25.16,26.89 25.16,23.98 | R12.1 25.16,23.98 | Q3.2 20.36,19.82 24.03,23.49 24.67,23.49 25.16,23.98 | 25.16,23.98
SWCLK  (via drill 0.51)
  Top 0.152: U8.49 17.71,37.15 v16.9,36.34 | v44.99,12.21 46.11,11.09 46.11,7.13 47.38,5.86 47.89,5.86 48.78,6.75 P1.4
  Bottom 0.152: v16.9,36.34 19.44,33.8 25.03,33.8 35.7,23.13 37.86,23.13 40.27,20.72 42.3,20.72 44.84,18.18 44.84,12.21 v44.99,12.21
SWDIO  (via drill 0.51)
  Top 0.152: U8.46 21.52,35.53 v21.98,35.07 | P1.2 47.38,8.15 v47.38,10.94
  Bottom 0.152: v21.98,35.07 24.52,35.07 27.06,32.53 34.68,24.91 42.3,24.91 47.63,19.58 47.63,11.19 v47.38,10.94
TXRX
  Top 0.152: C6.2 C7.2 46.1,42.7 46.74,43.34 47.75,44.34 U6.4
USB_DN  (via drill 0.35)
  Top 0.152: 10.02,7.42 J2.A7 | J2.A7 | J2.B7 9.08,7.4 9.08,6.33 v8.93,6.18 | U3.15 8.12,12.96 9.03,12.04 9.03,9.02 10.04,8.02 J2.A7 | J2.A7 10.06,7.42 10.06,6.88 10.22,6.71 v10.22,6.19
  Bottom 0.152: v10.22,6.19 10.21,6.18 v8.93,6.18
USB_DP
  Top 0.152: U3.14 7.62,13.01 8.73,11.9 8.73,8.85 9.49,8.09 9.49,7.56 9.54,7.52 J2.A6 9.54,5.65 9.66,5.53 10.42,5.53 10.87,5.97 10.87,6.56 10.58,6.85 10.58,7.4 J2.B6
USB_RX
  Top 0.152: U8.17 10.02,26.92 9.32,26.92 6.12,23.72 U3.30
USB_TX
  Top 0.152: U8.16 6.74,29.03 5.43,30.35 2.02,30.35 1.27,29.6 1.27,21.11 1.6,20.78 2.89,20.78 3.18,20.48 3.18,19.83 3.56,19.45 4.4,19.45 U3.2
USB_VCC
  Top 0.152: 13.22,9.67 JP1.2 13.63,10.73 15.42,10.73 | 13.22,9.67 JP1.1 | 13.22,9.67 12.19,8.64 J2.B4/A9 12.19,6.86 10.55,5.22 9.03,5.22 7.63,6.62 7.63,7.2 J2.A4/B9 7.39,8.01 7.07,8.33 5.37,8.33 4.3,9.39 4.3,11.1 2.55,12.85 USB_VCC.TP
  Top 0.254: R10.2 15.42,10.73 | 15.42,10.73 16.82,9.33 D3.A | Q2.P1 16.46,11.77 15.42,10.73
VDD_PA
  Top 0.152: L2.1 C4.1 49.87,39.15 50.09,38.93 50.09,37.15 49.67,36.72 | U1.11 47.76,35.45 49.03,36.72 49.67,36.72 | 49.67,36.72 C5.1 51.43,41.93 R15.2

### Text on the board
bPlace: Designed by Adam in California / (while Devin watched)